# EAGLE design YaskawaSpeedControl_RevB (EAGLE 7.6.0)

## Sheet 1 of 6
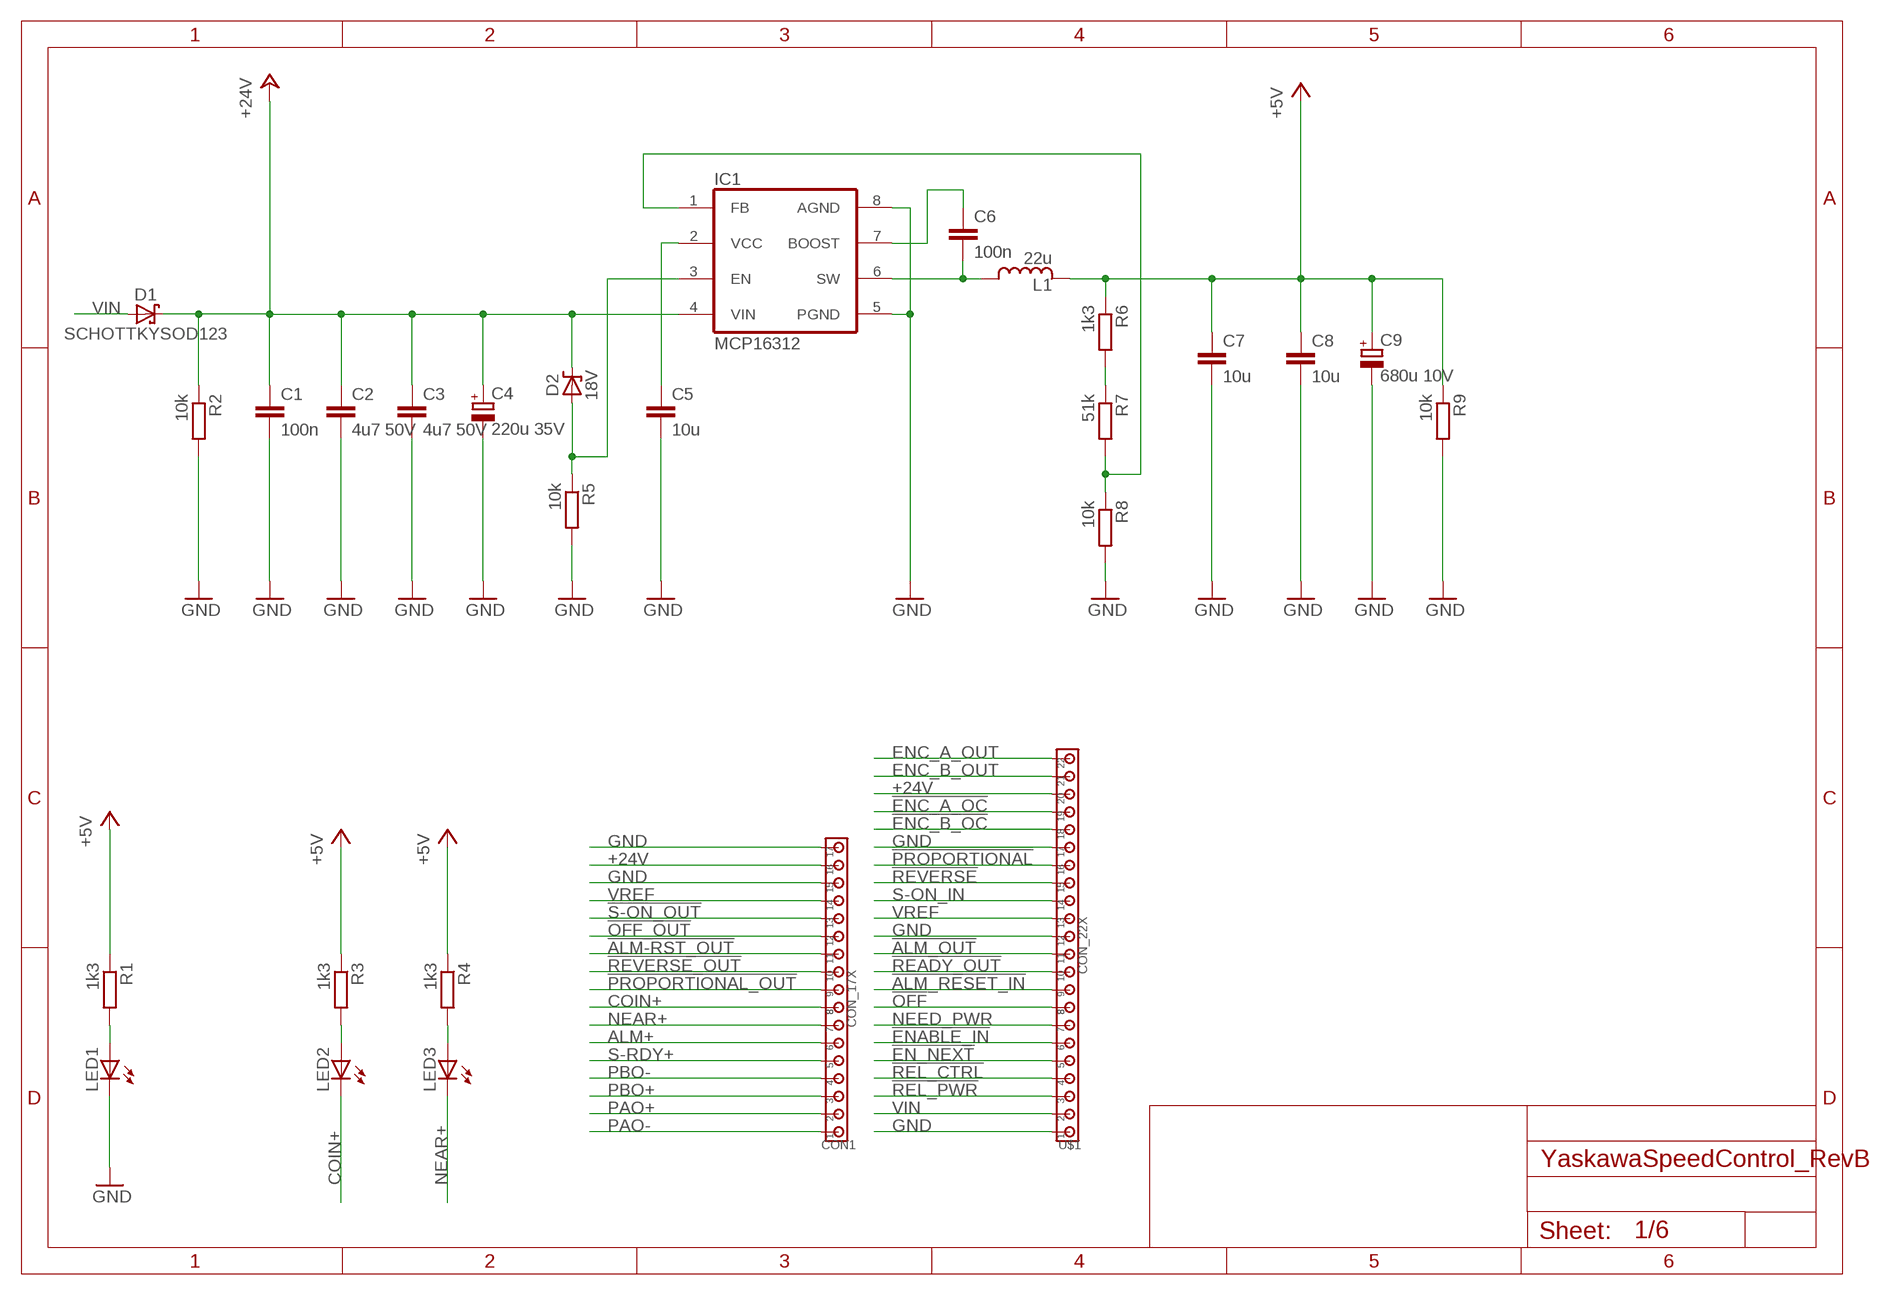
[diagram p0: schematic, sheet 1]

### Parts
C1  100n  CC0805  [C0805]
C2  4u7 50V  CC1206  [C1206]
C3  4u7 50V  CC1206  [C1206]
C4  220u 35V  C_POLARIZED8MM  [8MM]
C5  10u  CC0805  [C0805]
C6  100n  CC0805  [C0805]
C7  10u  CC0805  [C0805]
C8  10u  CC0805  [C0805]
C9  680u 10V  C_POLARIZED8MM  [8MM]
CON1  CON_17X  [3.5MM_17X]
D1  SCHOTTKYSOD123  [SOD123]
D2  18V  ZENERSOD323  [SOD323]
IC1  MCP16312  MCP16311  [MSOP8]
L1  22u  INDUCTORLPS4018  [LPS4018]
LED1  LED0805_NB  [LED0805_NOBOARDER]
LED2  LED0805_NB  [LED0805_NOBOARDER]
LED3  LED0805_NB  [LED0805_NOBOARDER]
R1  1k3  RESISTORR0805  [R0805]
R2  10k  RESISTORR0805  [R0805]
R3  1k3  RESISTORR0805  [R0805]
R4  1k3  RESISTORR0805  [R0805]
R5  10k  RESISTORR0805  [R0805]
R6  1k3  RESISTORR0805  [R0805]
R7  51k  RESISTORR0805  [R0805]
R8  10k  RESISTORR0805  [R0805]
R9  10k  RESISTORR0805  [R0805]
U$1  CON_22X  [3.5MM_22X]

### Nets
!ALM-RST_OUT!: CON1.11 ; also sheet 2
!ALM_OUT!: U$1.11 ; also sheet 2
!ALM_RESET_IN!: U$1.9 ; also sheet 5
!EN_NEXT!: U$1.5 ; also sheet 5
!ENABLE_IN!: U$1.6 ; also sheet 5
!ENC_A_OC!: U$1.19 ; also sheet 2
!ENC_B_OC!: U$1.18 ; also sheet 2
!OFF!: U$1.8 ; also sheet 5
!OFF_OUT!: CON1.12 ; also sheet 2
!PROPORTIONAL!: U$1.16 ; also sheet 6
!PROPORTIONAL_OUT!: CON1.9 ; also sheet 2
!READY_OUT!: U$1.10 ; also sheet 2
!REL_CTRL!: U$1.4 ; also sheet 5
!REL_PWR!: U$1.3 ; also sheet 5
!REVERSE!: U$1.15 ; also sheet 6
!REVERSE_OUT!: CON1.10 ; also sheet 2
!S-ON_OUT!: CON1.13 ; also sheet 2
+5V: C7.1 C8.1 C9.+ L1.2 R1.1 R3.1 R4.1 R6.1 R9.1 ; also sheet 2,3,4,5,6
+24V: C1.1 C2.1 C3.1 C4.+ CON1.16 D1.C D2.C IC1.4(VIN) R2.1 U$1.20 ; also sheet 2,5
ALM+: CON1.6 ; also sheet 5
BOOST: C6.1 IC1.7(BOOST)
COIN+: CON1.8 LED2.C
ENC_A_OUT: U$1.22 ; also sheet 4
ENC_B_OUT: U$1.21 ; also sheet 4
GND: C1.2 C2.2 C3.2 C4.- C5.2 C7.2 C8.2 C9.- CON1.15 CON1.17 IC1.5(PGND) IC1.8(AGND) LED1.C R2.2 R5.2 R8.2 R9.2 U$1.1 U$1.12 U$1.17 ; also sheet 2,3,4,5,6
N$1: IC1.1(FB) R7.2 R8.1
N$2: LED2.A R3.2
N$4: LED3.A R4.2
N$6: LED1.A R1.2
N$8: D2.A IC1.3(EN) R5.1
N$13: R6.2 R7.1
N$14: C5.1 IC1.2(VCC)
NEAR+: CON1.7 LED3.C
NEED_PWR: U$1.7 ; also sheet 5
PAO+: CON1.2 ; also sheet 4
PAO-: CON1.1 ; also sheet 4
PBO+: CON1.3 ; also sheet 4
PBO-: CON1.4 ; also sheet 4
S-ON_IN: U$1.14 ; also sheet 6
S-RDY+: CON1.5 ; also sheet 6
SWITCH: C6.2 IC1.6(SW) L1.1
VIN: D1.A U$1.2
VREF: CON1.14 U$1.13

## Sheet 2 of 6
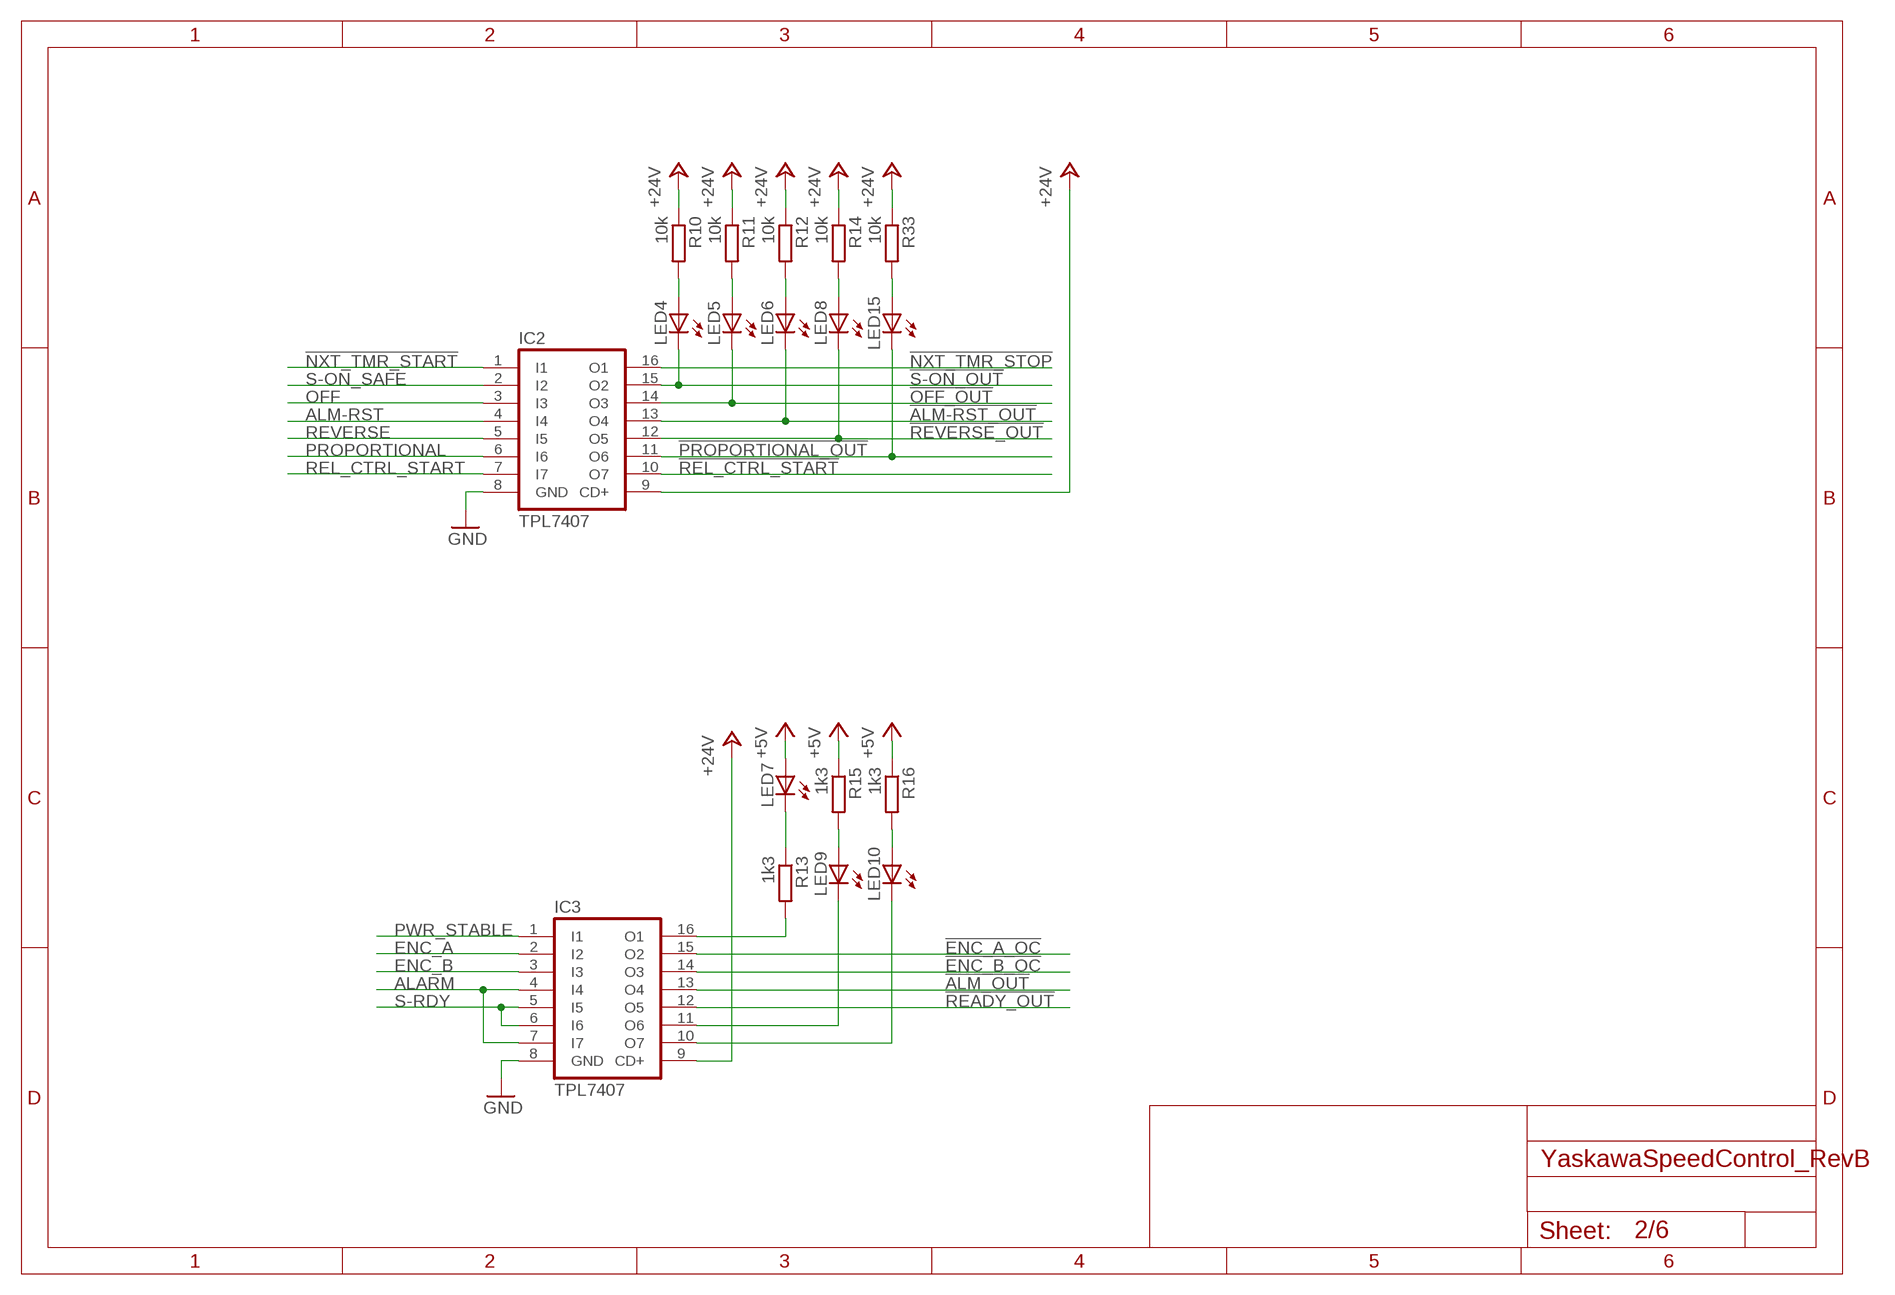
[diagram p1: schematic, sheet 2]

### Parts
IC2  TPL7407  ULN2003  [SO16]
IC3  TPL7407  ULN2003  [SO16]
LED4  LED0805_NB  [LED0805_NOBOARDER]
LED5  LED0805_NB  [LED0805_NOBOARDER]
LED6  LED0805_NB  [LED0805_NOBOARDER]
LED7  LED0805_NB  [LED0805_NOBOARDER]
LED8  LED0805_NB  [LED0805_NOBOARDER]
LED9  LED0805_NB  [LED0805_NOBOARDER]
LED10  LED0805_NB  [LED0805_NOBOARDER]
LED15  LED0805_NB  [LED0805_NOBOARDER]
R10  10k  RESISTORR0805  [R0805]
R11  10k  RESISTORR0805  [R0805]
R12  10k  RESISTORR0805  [R0805]
R13  1k3  RESISTORR0805  [R0805]
R14  10k  RESISTORR0805  [R0805]
R15  1k3  RESISTORR0805  [R0805]
R16  1k3  RESISTORR0805  [R0805]
R33  10k  RESISTORR0805  [R0805]

### Nets
!ALM-RST_OUT!: IC2.13(O4) LED6.C ; also sheet 1
!ALM_OUT!: IC3.13(O4) ; also sheet 1
!ALM_OUT_LED!: IC3.10(O7) LED10.C
!ENC_A_OC!: IC3.15(O2) ; also sheet 1
!ENC_B_OC!: IC3.14(O3) ; also sheet 1
!NXT_TMR_START!: IC2.1(I1) ; also sheet 5
!NXT_TMR_STOP!: IC2.16(O1) ; also sheet 3
!OFF_OUT!: IC2.14(O3) LED5.C ; also sheet 1
!PROPORTIONAL_OUT!: IC2.11(O6) LED15.C ; also sheet 1
!READY_OUT!: IC3.12(O5) ; also sheet 1
!READY_OUT_LED!: IC3.11(O6) LED9.C
!REL_CTRL_START!: IC2.10(O7) ; also sheet 3
!REVERSE_OUT!: IC2.12(O5) LED8.C ; also sheet 1
!S-ON_OUT!: IC2.15(O2) LED4.C ; also sheet 1
+5V: LED7.A R15.1 R16.1 ; also sheet 1,3,4,5,6
+24V: IC2.9(CD+) IC3.9(CD+) R10.1 R11.1 R12.1 R14.1 R33.1 ; also sheet 1,5
ALARM: IC3.4(I4) IC3.7(I7) ; also sheet 5
ALM-RST: IC2.4(I4) ; also sheet 5
ENC_A: IC3.2(I2) ; also sheet 4
ENC_B: IC3.3(I3) ; also sheet 4
GND: IC2.8(GND) IC3.8(GND) ; also sheet 1,3,4,5,6
N$5: LED7.C R13.1
N$22: LED15.A R33.2
N$31: LED4.A R10.2
N$32: IC3.16(O1) R13.2
N$34: LED5.A R11.2
N$35: LED6.A R12.2
N$36: LED8.A R14.2
N$49: LED9.A R15.2
N$50: LED10.A R16.2
OFF: IC2.3(I3) ; also sheet 5
PROPORTIONAL: IC2.6(I6) ; also sheet 6
PWR_STABLE: IC3.1(I1) ; also sheet 3
REL_CTRL_START: IC2.7(I7) ; also sheet 3
REVERSE: IC2.5(I5) ; also sheet 6
S-ON_SAFE: IC2.2(I2) ; also sheet 3
S-RDY: IC3.5(I5) IC3.6(I6) ; also sheet 3,6

## Sheet 3 of 6
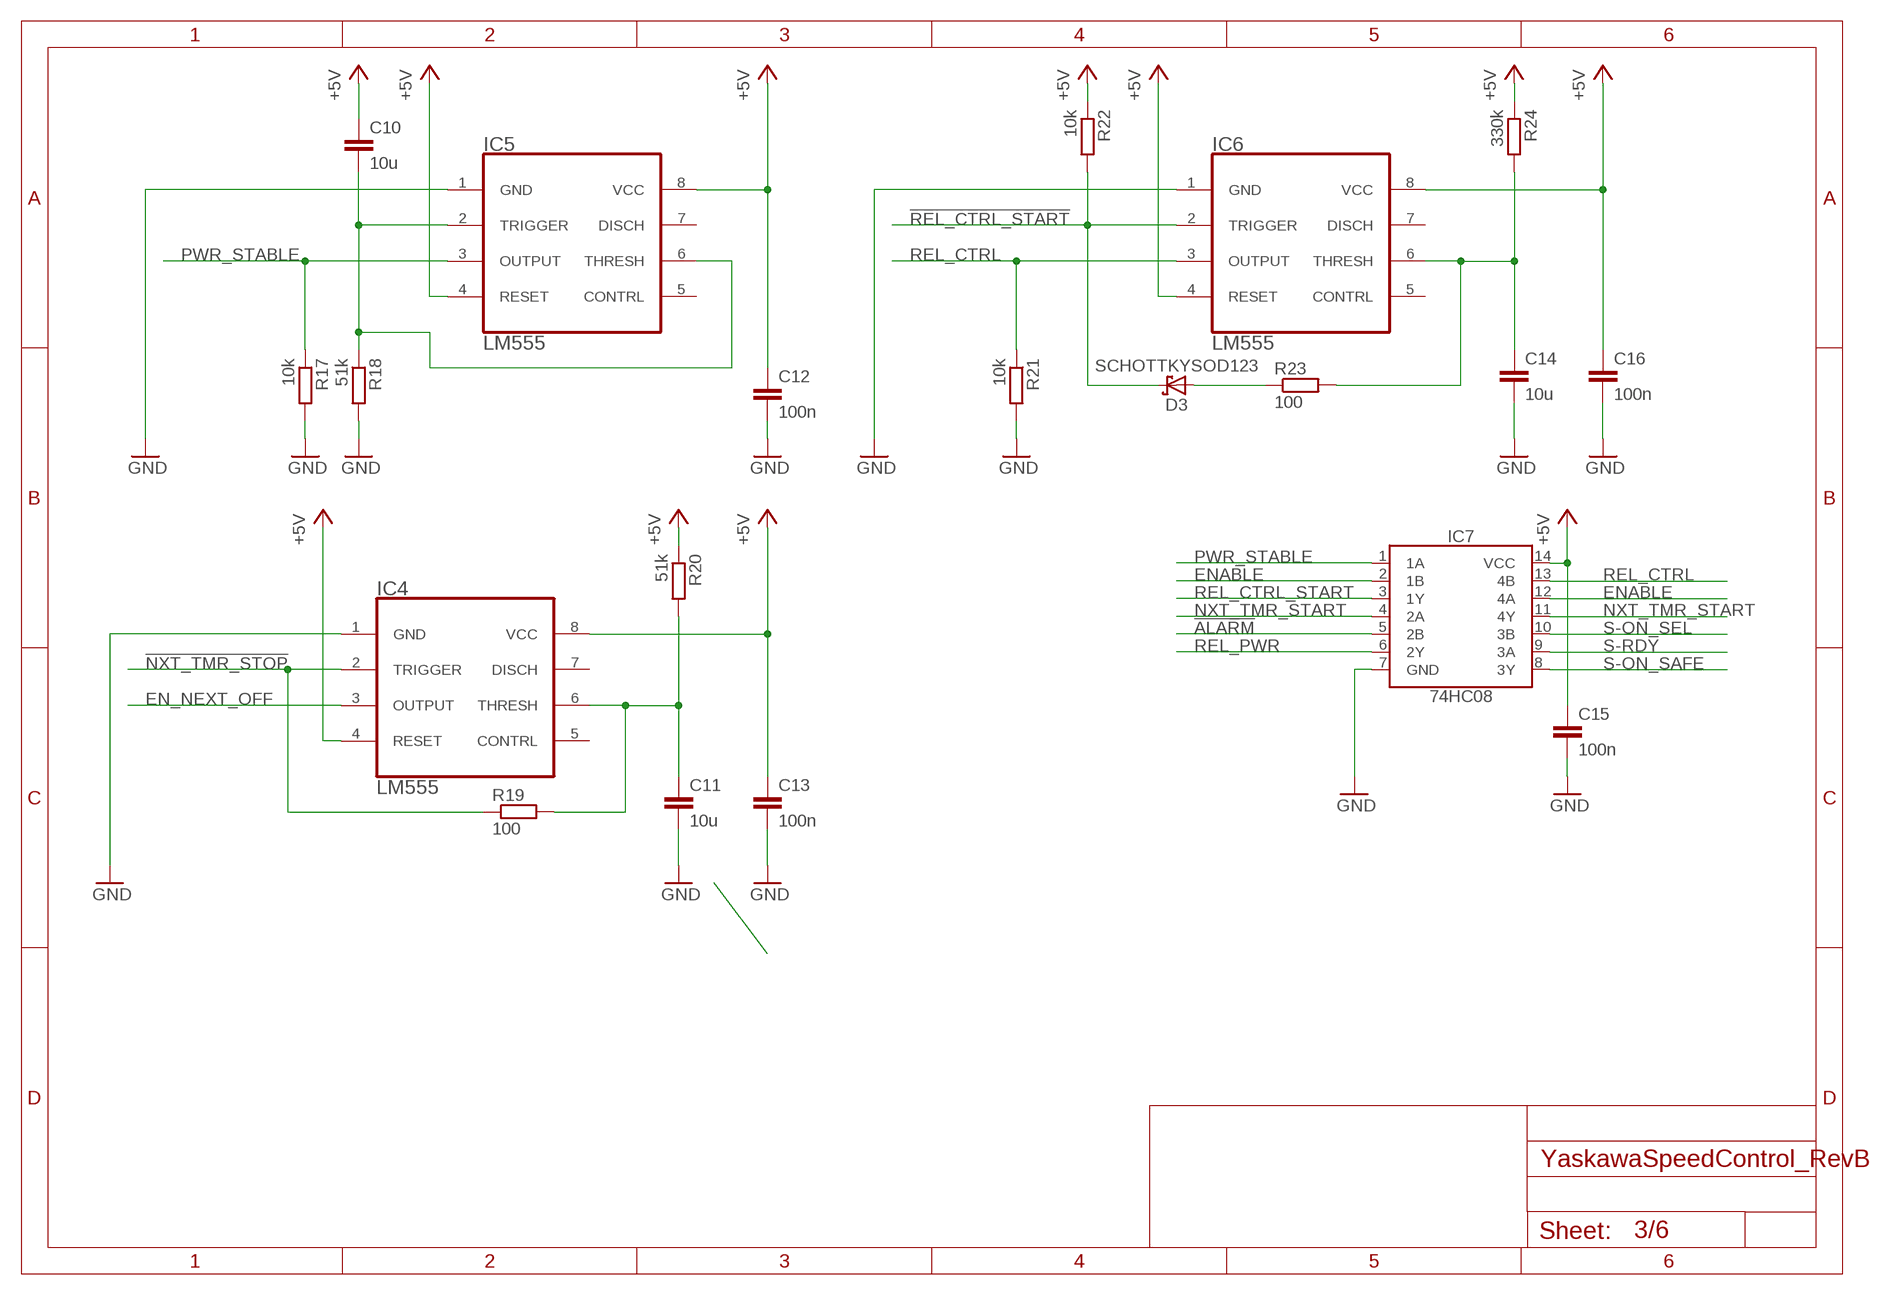
[diagram p2: schematic, sheet 3]

### Parts
C10  10u  CC0805  [C0805]
C11  10u  CC0805  [C0805]
C12  100n  CC0805  [C0805]
C13  100n  CC0805  [C0805]
C14  10u  CC0805  [C0805]
C15  100n  CC0805  [C0805]
C16  100n  CC0805  [C0805]
D3  SCHOTTKYSOD123  [SOD123]
IC4  LM555  [SOIC8]
IC5  LM555  [SOIC8]
IC6  LM555  [SOIC8]
IC7  74HC08  [SO14]
R17  10k  RESISTORR0805  [R0805]
R18  51k  RESISTORR0805  [R0805]
R19  100  RESISTORR0805  [R0805]
R20  51k  RESISTORR0805  [R0805]
R21  10k  RESISTORR0805  [R0805]
R22  10k  RESISTORR0805  [R0805]
R23  100  RESISTORR0805  [R0805]
R24  330k  RESISTORR0805  [R0805]

### Nets
!ALARM!: IC7.5(2B) ; also sheet 5
!NXT_TMR_STOP!: IC4.2(TRIGGER) R19.1 ; also sheet 2
!REL_CTRL_START!: D3.C IC6.2(TRIGGER) R22.2 ; also sheet 2
+5V: C10.1 C12.1 C13.1 C15.1 C16.1 IC4.4(RESET) IC4.8(VCC) IC5.4(RESET) IC5.8(VCC) IC6.4(RESET) IC6.8(VCC) IC7.14(VCC) R20.1 R22.1 R24.1 ; also sheet 1,2,4,5,6
EN_NEXT_OFF: IC4.3(OUTPUT) ; also sheet 6
ENABLE: IC7.2(1B) IC7.12(4A) ; also sheet 5
GND: C11.2 C12.2 C13.2 C14.2 C15.2 C16.2 IC4.1(GND) IC5.1(GND) IC6.1(GND) IC7.7(GND) R17.2 R18.2 R21.2 ; also sheet 1,2,4,5,6
N$11: C10.2 IC5.2(TRIGGER) IC5.6(THRESH) R18.1
N$12: C11.1 IC4.6(THRESH) R19.2 R20.2
N$15: C14.1 IC6.6(THRESH) R23.2 R24.2
N$20: D3.A R23.1
NXT_TMR_START: IC7.4(2A) IC7.11(4Y) ; also sheet 5
PWR_STABLE: IC5.3(OUTPUT) IC7.1(1A) R17.1 ; also sheet 2
REL_CTRL: IC6.3(OUTPUT) IC7.13(4B) R21.1 ; also sheet 5
REL_CTRL_START: IC7.3(1Y) ; also sheet 2
REL_PWR: IC7.6(2Y) ; also sheet 5
S-ON_SAFE: IC7.8(3Y) ; also sheet 2
S-ON_SEL: IC7.10(3B) ; also sheet 6
S-RDY: IC7.9(3A) ; also sheet 2,6
Unconnected: IC4.5(CONTRL) IC4.7(DISCH) IC5.5(CONTRL) IC5.7(DISCH) IC6.5(CONTRL) IC6.7(DISCH)

## Sheet 4 of 6
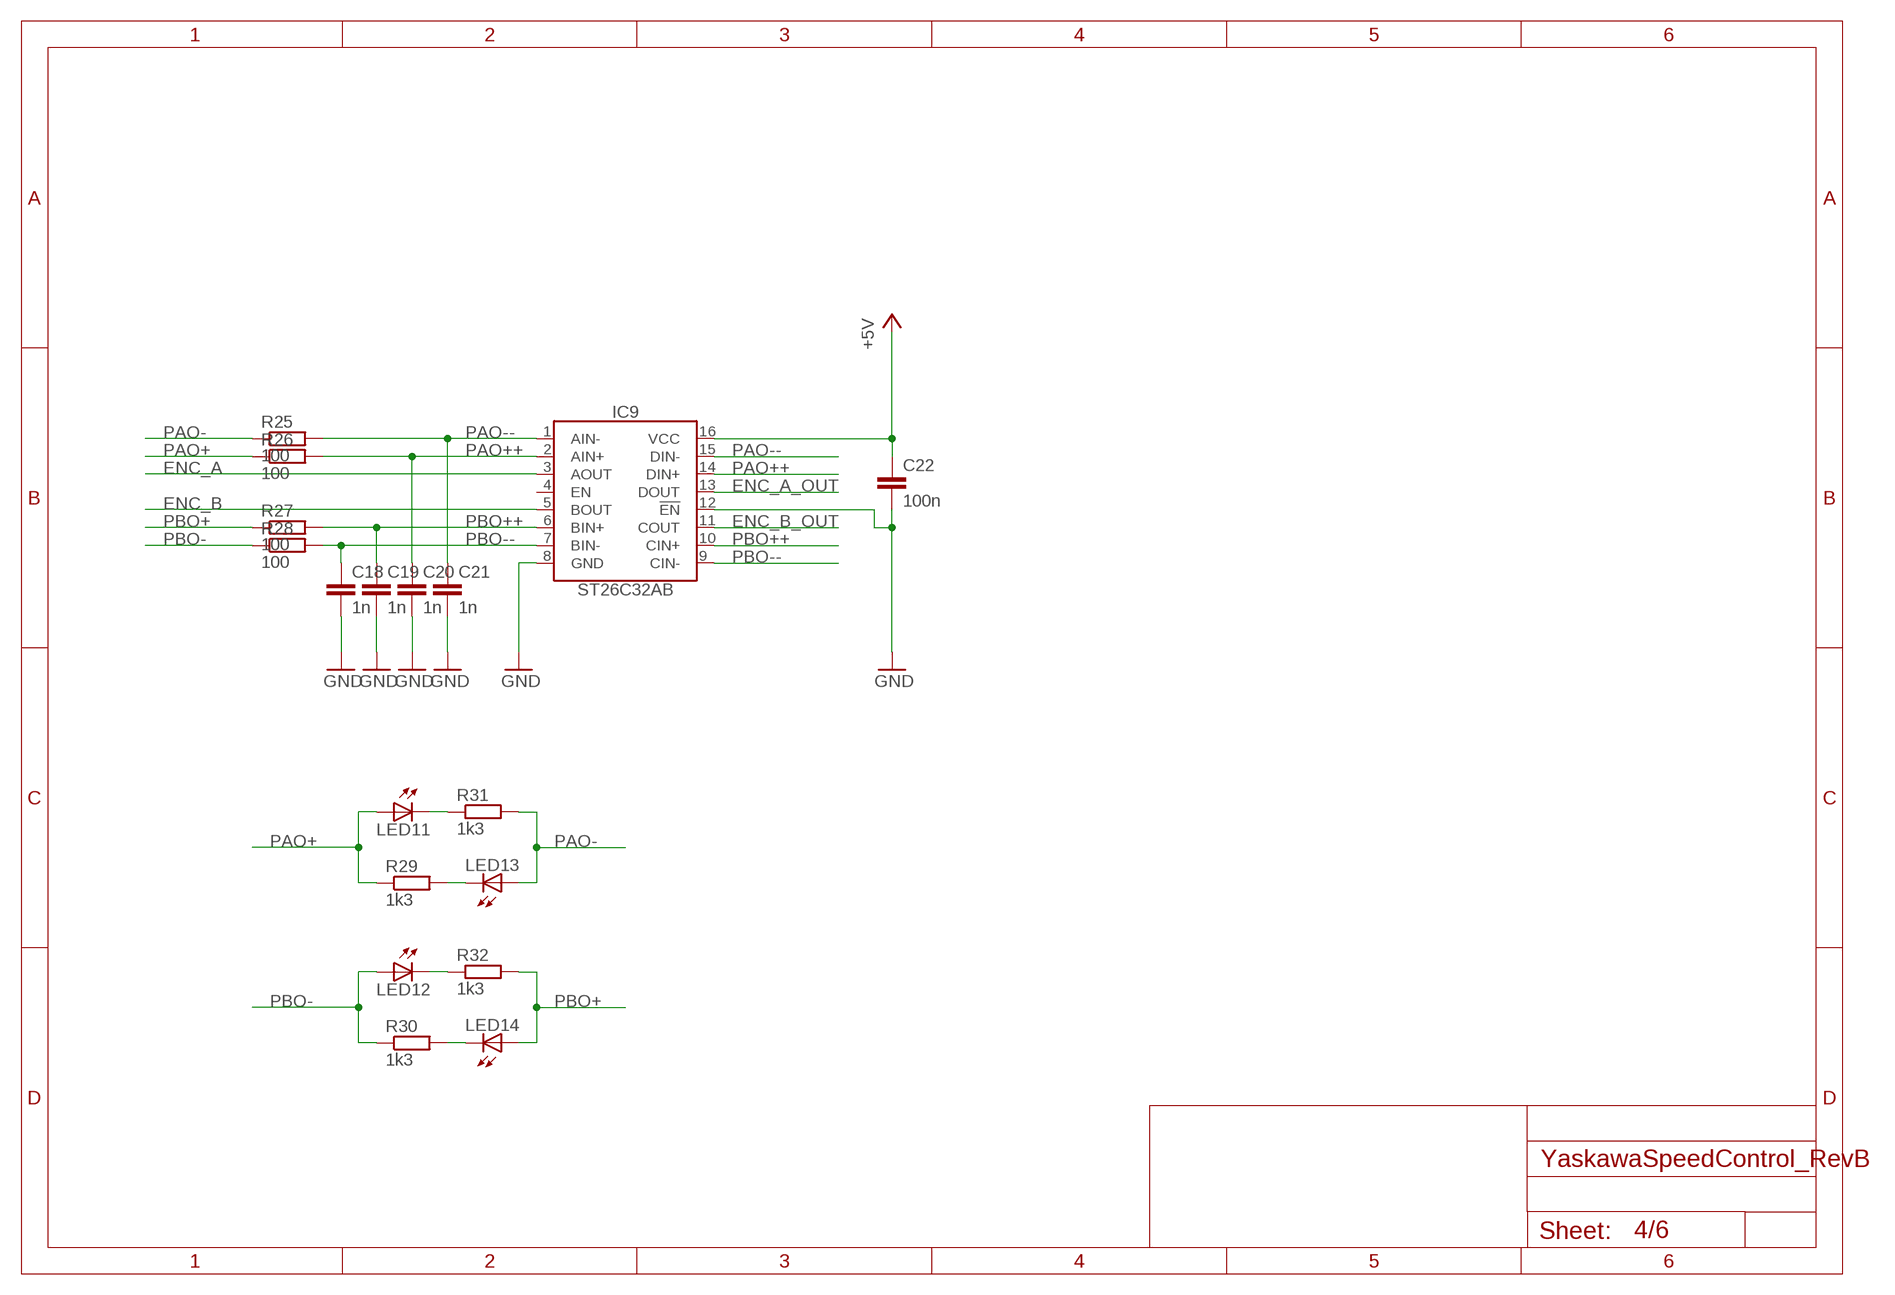
[diagram p3: schematic, sheet 4]

### Parts
C18  1n  CC0805  [C0805]
C19  1n  CC0805  [C0805]
C20  1n  CC0805  [C0805]
C21  1n  CC0805  [C0805]
C22  100n  CC0805  [C0805]
IC9  ST26C32AB  [SO16]
LED11  LED0805_NB  [LED0805_NOBOARDER]
LED12  LED0805_NB  [LED0805_NOBOARDER]
LED13  LED0805_NB  [LED0805_NOBOARDER]
LED14  LED0805_NB  [LED0805_NOBOARDER]
R25  100  RESISTORR0805  [R0805]
R26  100  RESISTORR0805  [R0805]
R27  100  RESISTORR0805  [R0805]
R28  100  RESISTORR0805  [R0805]
R29  1k3  RESISTORR0805  [R0805]
R30  1k3  RESISTORR0805  [R0805]
R31  1k3  RESISTORR0805  [R0805]
R32  1k3  RESISTORR0805  [R0805]

### Nets
+5V: C22.1 IC9.16(VCC) ; also sheet 1,2,3,5,6
ENC_A: IC9.3(AOUT) ; also sheet 2
ENC_A_OUT: IC9.13(DOUT) ; also sheet 1
ENC_B: IC9.5(BOUT) ; also sheet 2
ENC_B_OUT: IC9.11(COUT) ; also sheet 1
GND: C18.2 C19.2 C20.2 C21.2 C22.2 IC9.8(GND) IC9.12(!EN!) ; also sheet 1,2,3,5,6
N$18: LED11.C R31.1
N$19: LED12.C R32.1
N$51: LED13.C R29.2
N$53: LED14.C R30.2
PAO+: LED11.A R26.1 R29.1 ; also sheet 1
PAO++: C20.1 IC9.2(AIN+) IC9.14(DIN+) R26.2
PAO-: LED13.A R25.1 R31.2 ; also sheet 1
PAO--: C21.1 IC9.1(AIN-) IC9.15(DIN-) R25.2
PBO+: LED14.A R27.1 R32.2 ; also sheet 1
PBO++: C19.1 IC9.6(BIN+) IC9.10(CIN+) R27.2
PBO-: LED12.A R28.1 R30.1 ; also sheet 1
PBO--: C18.1 IC9.7(BIN-) IC9.9(CIN-) R28.2
Unconnected: IC9.4(EN)

## Sheet 5 of 6
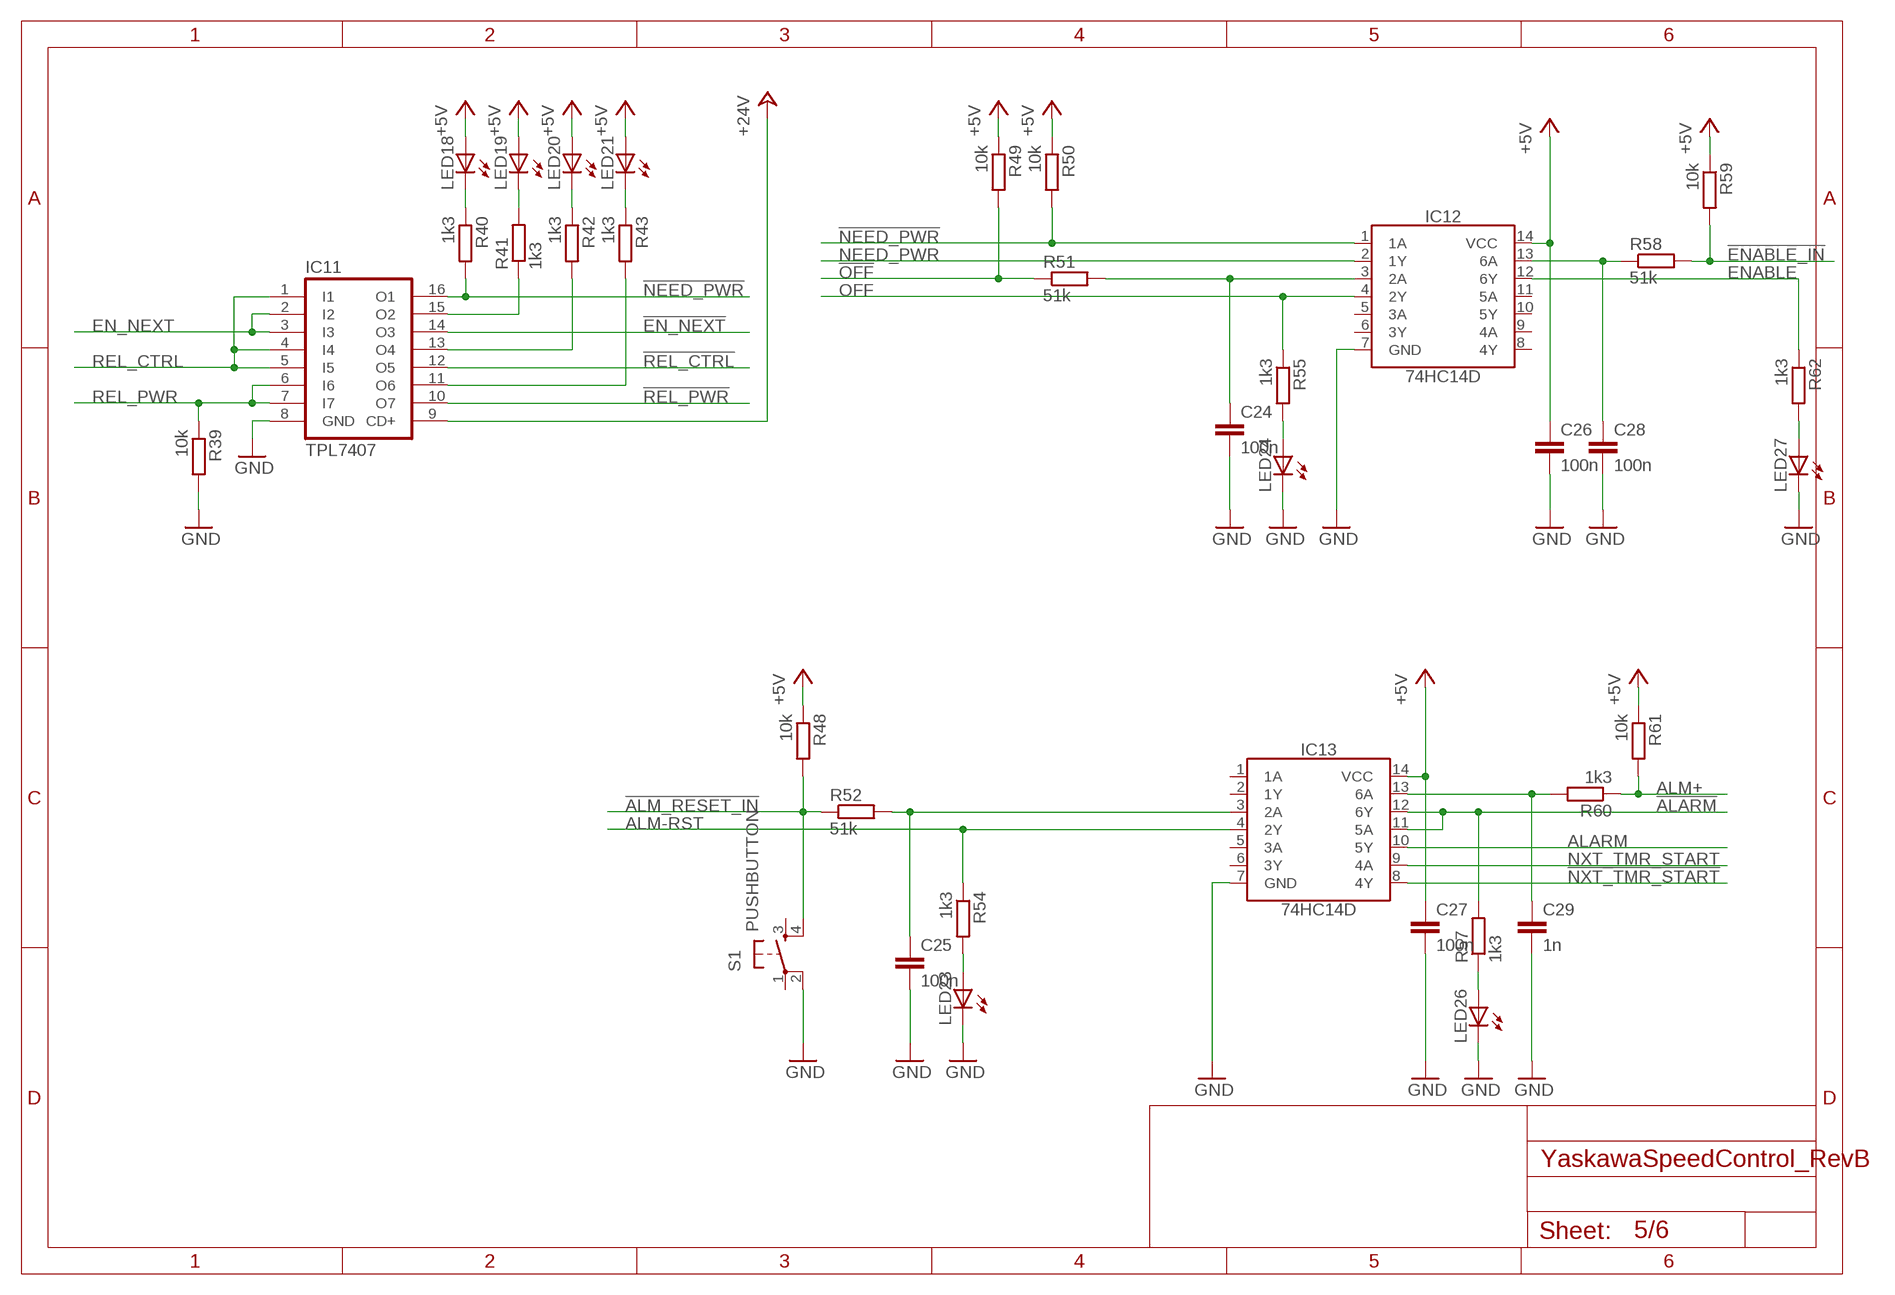
[diagram p4: schematic, sheet 5]

### Parts
C24  100n  CC0805  [C0805]
C25  100n  CC0805  [C0805]
C26  100n  CC0805  [C0805]
C27  100n  CC0805  [C0805]
C28  100n  CC0805  [C0805]
C29  1n  CC0805  [C0805]
IC11  TPL7407  ULN2003  [SO16]
IC12  74HC14D  [SO14]
IC13  74HC14D  [SO14]
LED18  LED0805_NB  [LED0805_NOBOARDER]
LED19  LED0805_NB  [LED0805_NOBOARDER]
LED20  LED0805_NB  [LED0805_NOBOARDER]
LED21  LED0805_NB  [LED0805_NOBOARDER]
LED23  LED0805_NB  [LED0805_NOBOARDER]
LED24  LED0805_NB  [LED0805_NOBOARDER]
LED26  LED0805_NB  [LED0805_NOBOARDER]
LED27  LED0805_NB  [LED0805_NOBOARDER]
R39  10k  RESISTORR0805  [R0805]
R40  1k3  RESISTORR0805  [R0805]
R41  1k3  RESISTORR0805  [R0805]
R42  1k3  RESISTORR0805  [R0805]
R43  1k3  RESISTORR0805  [R0805]
R48  10k  RESISTORR0805  [R0805]
R49  10k  RESISTORR0805  [R0805]
R50  10k  RESISTORR0805  [R0805]
R51  51k  RESISTORR0805  [R0805]
R52  51k  RESISTORR0805  [R0805]
R54  1k3  RESISTORR0805  [R0805]
R55  1k3  RESISTORR0805  [R0805]
R57  1k3  RESISTORR0805  [R0805]
R58  51k  RESISTORR0805  [R0805]
R59  10k  RESISTORR0805  [R0805]
R60  1k3  RESISTORR0805  [R0805]
R61  10k  RESISTORR0805  [R0805]
R62  1k3  RESISTORR0805  [R0805]
S1  PUSHBUTTON  [TE_FSMJSM]

### Nets
!ALARM!: IC13.11(5A) IC13.12(6Y) R57.2 ; also sheet 3
!ALM_RESET_IN!: R48.2 R52.1 S1.4(S1) ; also sheet 1
!EN_NEXT!: IC11.14(O3) ; also sheet 1
!EN_NEXT_LED!: IC11.15(O2) R41.1
!ENABLE_IN!: R58.2 R59.2 ; also sheet 1
!NEED_PWR!: IC11.16(O1) IC12.1(1A) R40.2 R50.2
!NXT_TMR_START!: IC13.8(4Y) ; also sheet 2
!OFF!: R49.2 R51.1 ; also sheet 1
!REL_CTRL!: IC11.12(O5) ; also sheet 1
!REL_CTRL_LED!: IC11.13(O4) R42.2
!REL_PWR!: IC11.10(O7) ; also sheet 1
!REL_PWR_LED!: IC11.11(O6) R43.2
+5V: C26.1 C27.1 IC12.14(VCC) IC13.14(VCC) LED18.A LED19.A LED20.A LED21.A R48.1 R49.1 R50.1 R59.1 R61.1 ; also sheet 1,2,3,4,6
+24V: IC11.9(CD+) ; also sheet 1,2
ALARM: IC13.10(5Y) ; also sheet 2
ALM+: R60.1 R61.2 ; also sheet 1
ALM++: C29.1 IC13.13(6A) R60.2
ALM-RST: IC13.4(2Y) R54.1 ; also sheet 2
EN_NEXT: IC11.2(I2) IC11.3(I3) ; also sheet 6
ENABLE: IC12.12(6Y) R62.1 ; also sheet 3
GND: C24.2 C25.2 C26.2 C27.2 C28.2 C29.2 IC11.8(GND) IC12.7(GND) IC13.7(GND) LED23.C LED24.C LED26.C LED27.C R39.2 S1.2(P1) ; also sheet 1,2,3,4,6
N$16: C28.1 IC12.13(6A) R58.1
N$21: C25.1 IC13.3(2A) R52.2
N$23: C24.1 IC12.3(2A) R51.2
N$38: LED23.A R54.2
N$39: LED24.A R55.2
N$40: LED19.C R41.2
N$41: LED18.C R40.1
N$43: LED20.C R42.1
N$45: LED21.C R43.1
N$46: LED27.A R62.2
N$55: LED26.A R57.1
NEED_PWR: IC12.2(1Y) ; also sheet 1
NXT_TMR_START: IC13.9(4A) ; also sheet 3
OFF: IC12.4(2Y) R55.1 ; also sheet 2
REL_CTRL: IC11.1(I1) IC11.4(I4) IC11.5(I5) ; also sheet 3
REL_PWR: IC11.6(I6) IC11.7(I7) R39.1 ; also sheet 3
Unconnected: IC12.5(3A) IC12.6(3Y) IC12.8(4Y) IC12.9(4A) IC12.10(5Y) IC12.11(5A) IC13.1(1A) IC13.2(1Y) IC13.5(3A) IC13.6(3Y) S1.1(P) S1.3(S)

## Sheet 6 of 6
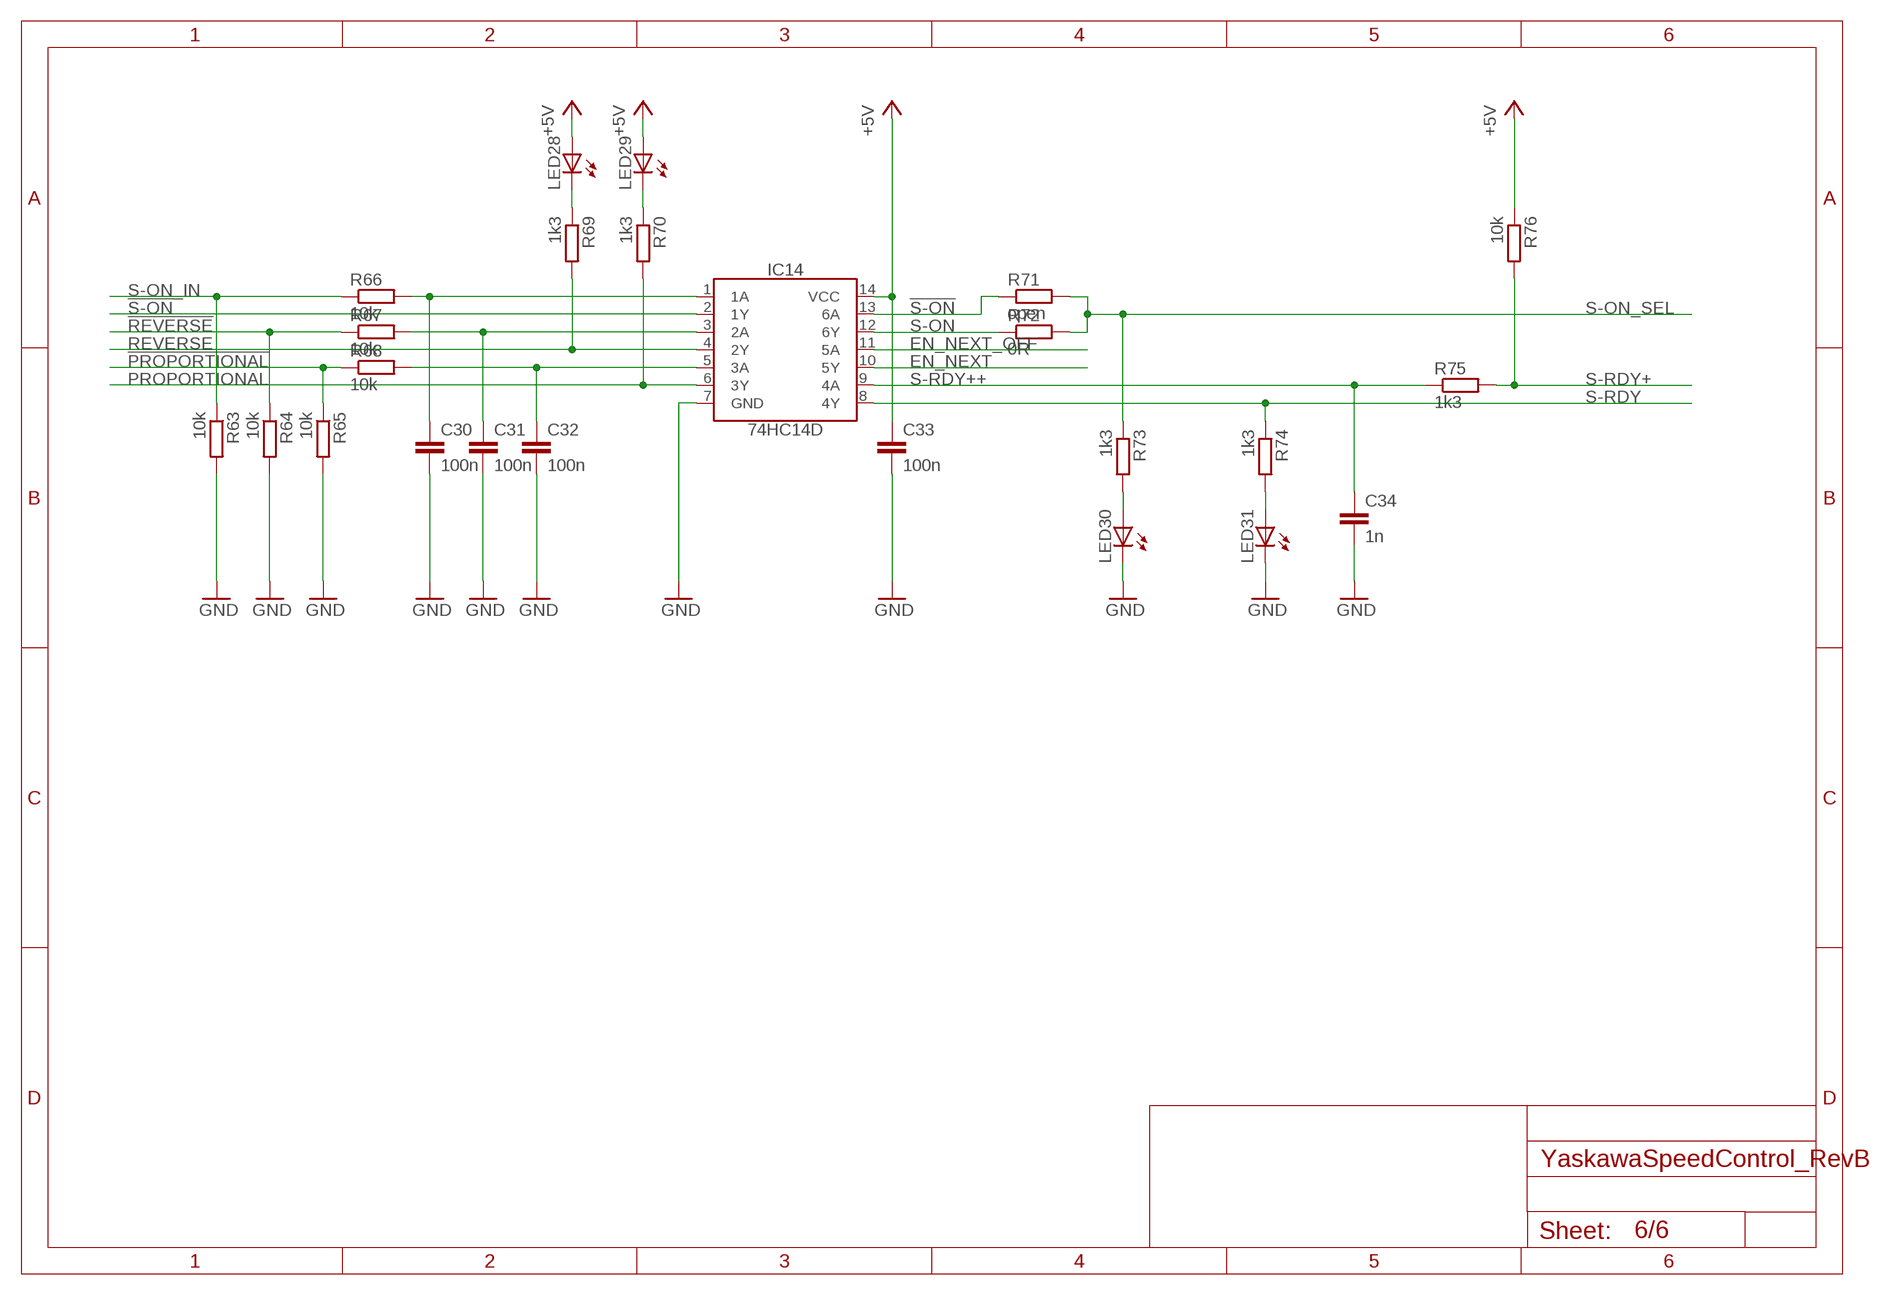
[diagram p5: schematic, sheet 6]

### Parts
C30  100n  CC0805  [C0805]
C31  100n  CC0805  [C0805]
C32  100n  CC0805  [C0805]
C33  100n  CC0805  [C0805]
C34  1n  CC0805  [C0805]
IC14  74HC14D  [SO14]
LED28  LED0805_NB  [LED0805_NOBOARDER]
LED29  LED0805_NB  [LED0805_NOBOARDER]
LED30  LED0805_NB  [LED0805_NOBOARDER]
LED31  LED0805_NB  [LED0805_NOBOARDER]
R63  10k  RESISTORR0805  [R0805]
R64  10k  RESISTORR0805  [R0805]
R65  10k  RESISTORR0805  [R0805]
R66  10k  RESISTORR0805  [R0805]
R67  10k  RESISTORR0805  [R0805]
R68  10k  RESISTORR0805  [R0805]
R69  1k3  RESISTORR0805  [R0805]
R70  1k3  RESISTORR0805  [R0805]
R71  open  RESISTORR0805  [R0805]
R72  0R  RESISTORR0805  [R0805]
R73  1k3  RESISTORR0805  [R0805]
R74  1k3  RESISTORR0805  [R0805]
R75  1k3  RESISTORR0805  [R0805]
R76  10k  RESISTORR0805  [R0805]

### Nets
!PROPORTIONAL!: R65.1 R68.1 ; also sheet 1
!REVERSE!: R64.1 R67.1 ; also sheet 1
!S-ON!: IC14.2(1Y) IC14.13(6A) R71.1
+5V: C33.1 IC14.14(VCC) LED28.A LED29.A R76.1 ; also sheet 1,2,3,4,5
EN_NEXT: IC14.10(5Y) ; also sheet 5
EN_NEXT_OFF: IC14.11(5A) ; also sheet 3
GND: C30.2 C31.2 C32.2 C33.2 C34.2 IC14.7(GND) LED30.C LED31.C R63.2 R64.2 R65.2 ; also sheet 1,2,3,4,5
N$17: LED29.C R70.1
N$27: C30.1 IC14.1(1A) R66.2
N$28: C31.1 IC14.3(2A) R67.2
N$29: C32.1 IC14.5(3A) R68.2
N$30: LED28.C R69.1
N$33: LED30.A R73.2
N$56: LED31.A R74.2
PROPORTIONAL: IC14.6(3Y) R70.2 ; also sheet 2
REVERSE: IC14.4(2Y) R69.2 ; also sheet 2
S-ON: IC14.12(6Y) R72.1
S-ON_IN: R63.1 R66.1 ; also sheet 1
S-ON_SEL: R71.2 R72.2 R73.1 ; also sheet 3
S-RDY: IC14.8(4Y) R74.1 ; also sheet 2,3
S-RDY+: R75.2 R76.2 ; also sheet 1
S-RDY++: C34.1 IC14.9(4A) R75.1

## Library data of the parts
C1-C3 C5-C8 C10-C16 C18-C22 C24-C34 = 00Capacitor:C: Capacitor
C4 C9 = 00Capacitor:C_POLARIZED
CON1 = 00Connector:CON_17X
D1 D3 = 00Diode:SCHOTTKY
D2 = 00Diode:ZENER
IC1 = 00VoltageRegulator:MCP16311
IC2 IC3 IC11 = 00Transistor:ULN2003: Seven Darlington array
IC4-IC6 = 00Logic:LM555
IC7 = 00Logic:74HC08: Quad 2-input AND gate
IC9 = 00Logic:ST26C32AB: CMOS quad 3-state differential line receiver
IC12-IC14 = 00Logic:74HC14: Hex Inverter Schmitt Trigger
L1 = 00Inductor:INDUCTOR
LED1-LED15 LED18-LED21 LED23 LED24 LED26-LED31 = 00Display:LED: LED
R1-R33 R39-R43 R48-R52 R54 R55 R57-R76 = 00Resistor:RESISTOR: RESISTOR, European symbol
S1 = 00Switch:PUSHBUTTON: Pushbutton
U$1 = 00Connector:CON_22X

## Net classes
1 24V: clearance 0.305 mm
5 +5v: width 0.61 mm, drill 0.6 mm, clearance 0.254 mm to class 0, clearance 0.254 mm to class 1, clearance 0.254 mm to class 2, clearance 0.254 mm to class 3, clearance 0.254 mm to class 4, clearance 0.254 mm

## Board
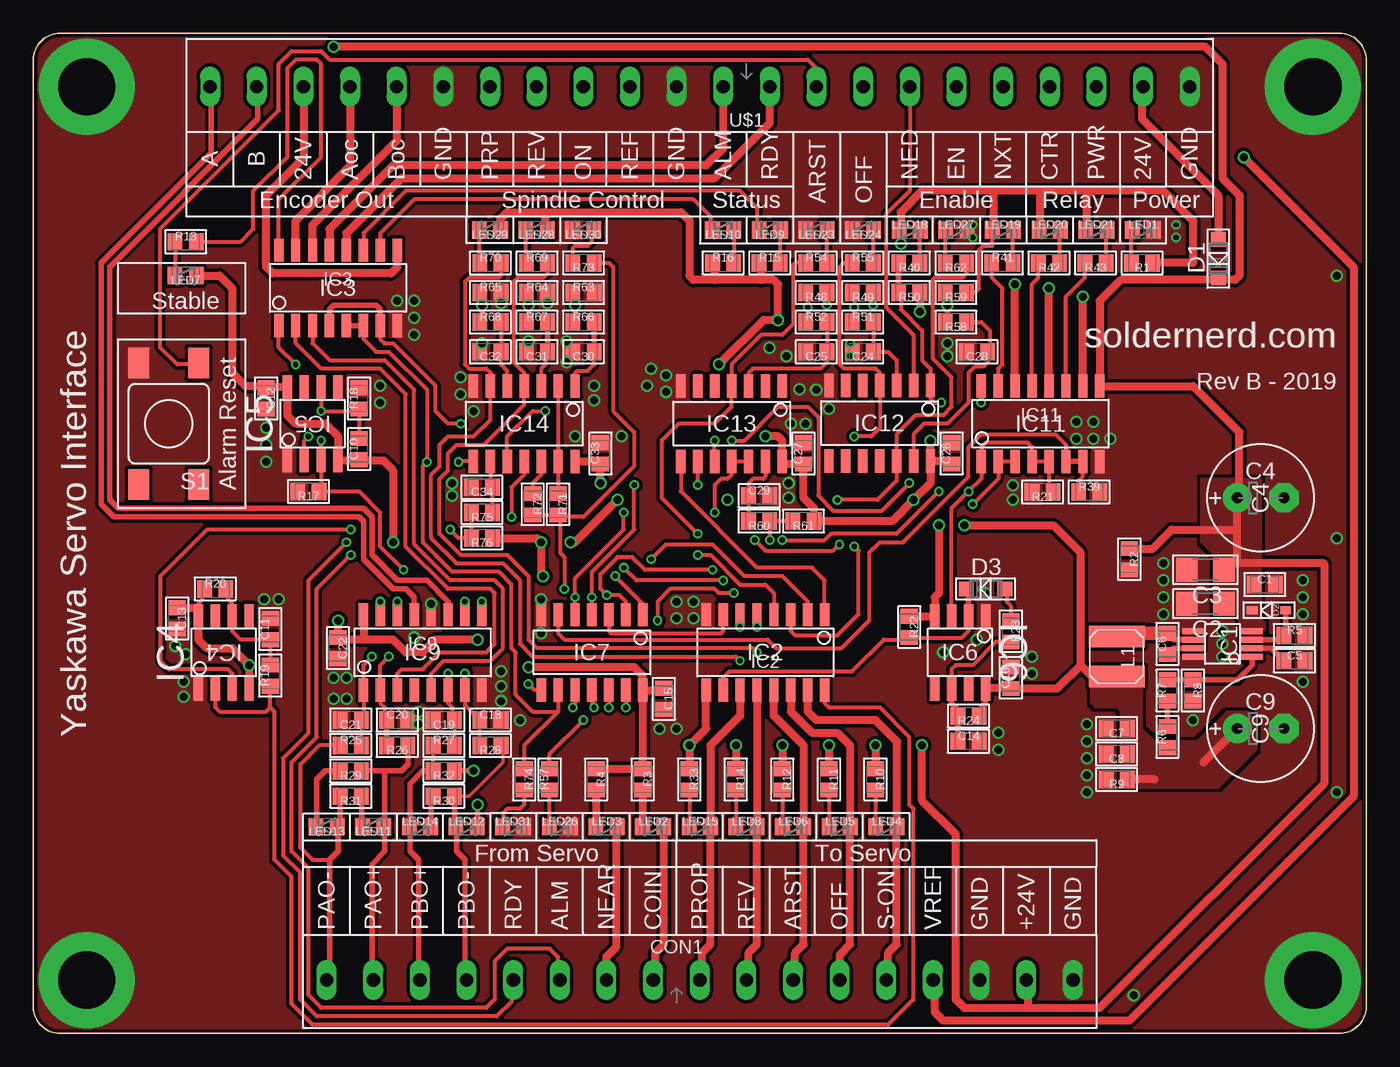
[diagram p6: board, top side]
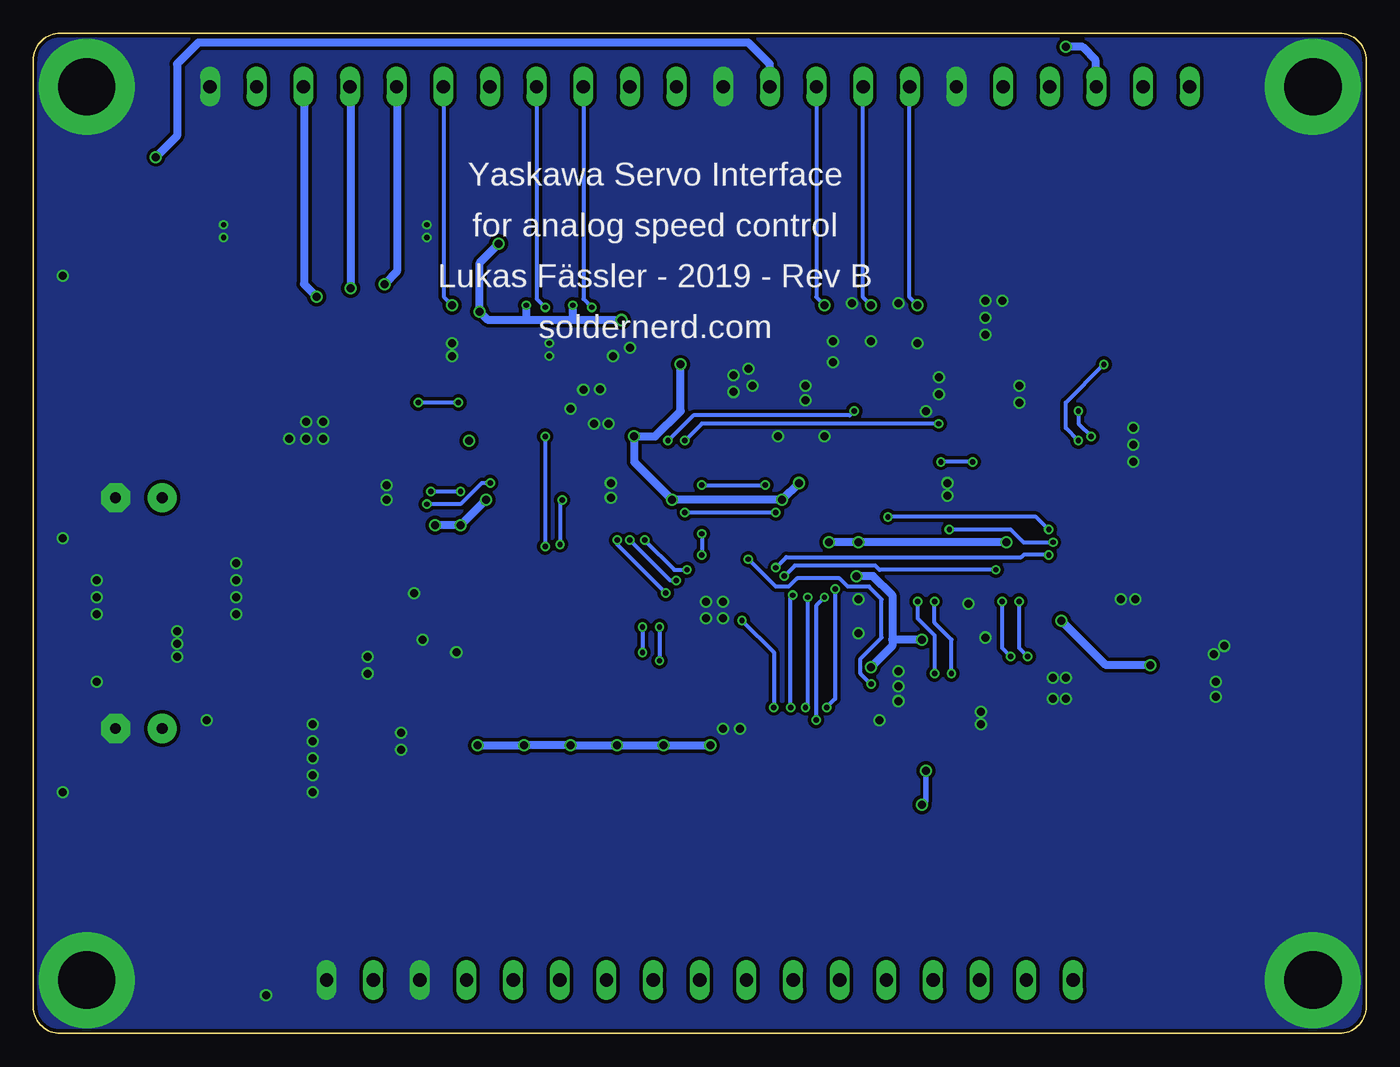
[diagram p7: board, bottom side, seen from below]

Size 100 x 75 mm. Coordinates in mm from the lower left corner, seen from the top.
Outline: 98,0 arc90 100,2 100,73 arc90 98,75 2,75 arc90 0,73 0,2 arc90 2,0 98,0
Copper layers (1*16): Top 0.035mm / dielectric 1.5mm / Bottom 0.035mm
Design rules "dirt_cheap_dirty_boards.6mil": minimum track width 6mil, minimum drill 12mil, track to track 6mil, track to pad 6mil, pad to pad 6mil, via to via 6mil, smd to smd 0mil, copper to edge 10mil, drill to drill 10mil, minimum pad ring 8mil, minimum via ring 6mil, stop-mask expansion 2mil, vias tented up to drill 25mil, thermal gap 10mil

### Footprints (pad centres in the part's own frame; a part is rotated, then mirrored left to right if it is on the bottom)
C0805 = smd 1.1 x 1.3: 1 -0.8,0; 2 0.8,0
C1206 = smd 1.6 x 1.8: 1 -1.4,0; 2 1.4,0
8MM = drill 0.8 pad 2.2: + -1.75,0 | drill 0.8 pad 2.2 octagon: - 1.75,0
3.5MM_17X = drill 1 long: 1 -28,0; 2 -24.5,0; 3 -21,0; 4 -17.5,0; 5 -14,0; 6 -10.5,0; 7 -7,0; 8 -3.5,0; 9 0,0; 10 3.5,0; 11 7,0; 12 10.5,0; 13 14,0; 14 17.5,0; 15 21,0; 16 24.5,0; 17 28,0
SOD123 = smd 1.1 x 1.1: A 1.45,0; C -1.45,0
SOD323 = smd 0.8 x 0.6: A 1.25,0; C -1.25,0
MSOP8 = smd 1.65 x 0.45: 1 -2.2,0.953; 2 -2.2,0.318; 3 -2.2,-0.318; 4 -2.2,-0.953; 5 2.2,-0.953; 6 2.2,-0.318; 7 2.2,0.318; 8 2.2,0.953
SO16 = smd 0.7 x 1.75: 1 -4.445,-2.825; 2 -3.175,-2.825; 3 -1.905,-2.825; 4 -0.635,-2.825; 5 0.635,-2.825; 6 1.905,-2.825; 7 3.175,-2.825; 8 4.445,-2.825; 9 4.445,2.825; 10 3.175,2.825; 11 1.905,2.825; 12 0.635,2.825; 13 -0.635,2.825; 14 -1.905,2.825; 15 -3.175,2.825; 16 -4.445,2.825
SOIC8 = smd 1.75 x 0.7: 1 -2.75,1.905; 2 -2.75,0.635; 3 -2.75,-0.635; 4 -2.75,-1.905; 5 2.75,-1.905; 6 2.75,-0.635; 7 2.75,0.635; 8 2.75,1.905
SO14 = smd 0.7 x 1.75: 1 -3.81,-2.825; 2 -2.54,-2.825; 3 -1.27,-2.825; 4 0,-2.825; 5 1.27,-2.825; 6 2.54,-2.825; 7 3.81,-2.825; 8 3.81,2.825; 9 2.54,2.825; 10 1.27,2.825; 11 0,2.825; 12 -1.27,2.825; 13 -2.54,2.825; 14 -3.81,2.825
LPS4018 = smd 1.6 x 4.2: 1 -1.5,0; 2 1.5,0
LED0805_NOBOARDER = smd 1.1 x 1.3: A -0.8,0; C 0.8,0
R0805 = smd 1.1 x 1.3: 1 -0.8,0; 2 0.8,0
TE_FSMJSM = smd 1.6 x 2.3: 1 2.25,4.55; 2 2.25,-4.55; 3 -2.25,4.55; 4 -2.25,-4.55
3.5MM_22X = drill 1 long: 1 -36.75,0; 2 -33.25,0; 3 -29.75,0; 4 -26.25,0; 5 -22.75,0; 6 -19.25,0; 7 -15.75,0; 8 -12.25,0; 9 -8.75,0; 10 -5.25,0; 11 -1.75,0; 12 1.75,0; 13 5.25,0; 14 8.75,0; 15 12.25,0; 16 15.75,0; 17 19.25,0; 18 22.75,0; 19 26.25,0; 20 29.75,0; 21 33.25,0; 22 36.75,0

### Placement (x,y rotation side)
C1  92.39,33.66 0 top
C2  87.95,32.23 180 top
C3  87.95,34.77 180 top
C4  92.08,40.16 0 top
C5  94.61,27.94 0 top
C6  85.09,29.21 90 top
C7  81.28,22.86 180 top
C8  81.28,20.95 180 top
C9  92.08,22.86 0 top
C10  24.45,43.81 90 top
C11  17.78,30.32 90 top
C12  17.46,47.62 270 top
C13  10.79,31.11 270 top
C14  70.17,21.91 0 top
C15  47.31,25.08 270 top
C16  73.34,26.67 90 top
C18  34.29,23.5 0 top
C19  30.8,23.5 180 top
C20  27.3,23.5 0 top
C21  23.81,23.5 180 top
C22  22.86,28.89 270 top
C24  62.23,51.12 180 top
C25  58.74,51.12 180 top
C26  68.9,43.5 90 top
C27  57.78,43.5 90 top
C28  70.8,51.12 180 top
C29  54.45,40.32 0 top
C30  41.27,51.12 180 top
C31  37.78,51.12 180 top
C32  34.29,51.12 180 top
C33  42.55,43.5 90 top
C34  33.66,40.96 180 top
CON1  50,4 0 top
D1  88.9,58.1 90 top
D2  92.71,31.75 0 top
D3  71.44,33.34 0 top
IC1  89.22,29.21 180 top
IC2  54.93,28.57 180 top
IC3  22.86,55.9 0 top
IC4  14.29,28.57 90 top
IC5  20.95,45.72 90 top
IC6  69.53,28.57 270 top
IC7  41.91,28.57 180 top
IC9  29.21,28.57 0 top
IC11  75.56,45.72 0 top
IC12  63.5,45.76 180 top
IC13  52.39,45.72 180 top
IC14  36.83,45.72 180 top
L1  81.28,28.26 270 top
LED1  83.25,60.25 0 top
LED2  46.5,15.5 0 top
LED3  43,15.5 0 top
LED4  64,15.5 0 top
LED5  60.5,15.5 0 top
LED6  57,15.5 0 top
LED7  11.43,56.83 180 top
LED8  53.5,15.5 0 top
LED9  55.25,60.25 180 top
LED10  51.75,60.25 180 top
LED11  25.5,15.5 180 top
LED12  32.5,15.5 0 top
LED13  22,15.5 180 top
LED14  29,15.5 0 top
LED15  50,15.5 0 top
LED18  65.75,60.25 0 top
LED19  72.75,60.25 0 top
LED20  76.25,60.25 0 top
LED21  79.75,60.25 0 top
LED23  58.75,60.25 180 top
LED24  62.25,60.25 180 top
LED26  39.5,15.5 0 top
LED27  69.25,60.25 0 top
LED28  37.75,60.25 180 top
LED29  34.25,60.25 180 top
LED30  41.25,60.25 180 top
LED31  36,15.5 0 top
R1  83.19,57.78 180 top
R2  82.23,35.56 270 top
R3  45.72,19.05 270 top
R4  42.23,19.05 270 top
R5  94.61,29.84 0 top
R6  85.09,22.23 90 top
R7  85.09,25.72 90 top
R8  87,25.72 270 top
R9  81.28,19.05 180 top
R10  63.18,19.05 270 top
R11  59.69,19.05 270 top
R12  56.2,19.05 270 top
R13  11.43,59.37 0 top
R14  52.7,19.05 270 top
R15  55.24,57.78 0 top
R16  51.75,57.78 0 top
R17  20.64,40.64 180 top
R18  24.45,47.62 90 top
R19  17.78,26.83 90 top
R20  13.65,33.34 0 top
R21  75.72,40.6 180 top
R22  65.72,30.48 270 top
R23  73.34,30.16 270 top
R24  70.17,23.81 180 top
R25  23.81,21.59 0 top
R26  27.3,21.59 180 top
R27  30.8,21.59 0 top
R28  34.29,21.59 180 top
R29  23.81,19.68 180 top
R30  30.8,17.78 180 top
R31  23.81,17.78 180 top
R32  30.8,19.68 180 top
R33  49.21,19.05 270 top
R39  79.22,40.6 0 top
R40  65.72,57.78 180 top
R41  72.71,57.78 0 top
R42  76.2,57.78 180 top
R43  79.69,57.78 180 top
R48  58.74,55.56 180 top
R49  62.23,55.56 180 top
R50  65.72,55.56 180 top
R51  62.23,53.34 0 top
R52  58.74,53.34 0 top
R54  58.74,57.78 0 top
R55  62.23,57.78 0 top
R57  38.73,19.05 90 top
R58  69.22,53.34 180 top
R59  69.22,55.56 180 top
R60  54.45,38.42 180 top
R61  57.78,38.42 180 top
R62  69.22,57.78 180 top
R63  41.27,55.56 0 top
R64  37.78,55.56 0 top
R65  34.29,55.56 0 top
R66  41.27,53.34 0 top
R67  37.78,53.34 0 top
R68  34.29,53.34 0 top
R69  37.78,57.78 0 top
R70  34.29,57.78 0 top
R71  39.37,39.69 270 top
R72  37.47,39.69 270 top
R73  41.27,57.78 180 top
R74  36.83,19.05 270 top
R75  33.66,39.05 180 top
R76  33.66,37.15 180 top
S1  10.16,45.72 180 top
U$1  50,71 180 top

### Tracks (layer width: path | path; a pad name or v marks a point on that pad's centre or on a via)
!ALARM!  (via drill 0.4)
  Top 0.305: IC7.5 v40.64,32.7 40.64,34.13 44.29,37.78 v44.29,39.05 | IC13.12 IC13.11 52.39,41.91 52.07,41.59 51.59,41.59 51.12,41.12 v51.12,39.05 | R57.2 38.73,20.95 v41.27,23.5
  Bottom 0.305: v40.64,32.7 41.27,32.07 v41.27,23.5 | v44.29,39.05 v51.12,39.05
!ALM-RST_OUT!
  Top 0.61: CON1.11 57.02,4 57.15,4.13 57.15,6.03 57.78,6.67 57.78,15.48 LED6.C 57.8,21.57 55.56,23.81 IC2.13
!ALM_OUT!
  Top 0.61: U$1.11 51.75,70.81 51.75,70.8 51.75,66.36 50.48,65.09 26.99,65.09 22.23,60.33 IC3.13
!ALM_OUT_LED!
  Top 0.305: LED10.C 50.8,60.4 50.8,61.28 49.53,62.55 28.57,62.55 26.04,60.01 IC3.10
!ALM_RESET_IN!  (via drill 0.4)
  Top 0.305: U$1.9 58.75,71.11 58.74,71.12 58.74,72.39 58.1,73.03 22.23,73.03 21.59,73.66 19.37,73.66 18.41,72.71 18.41,69.22 9.53,60.33 9.53,51.44 10.79,50.16 12.38,50.16 12.38,50.24 S1.4
  Top 0.406: R52.1 58.1,53.34 v58.1,54.45 58.1,55.56 R48.2
  Bottom 0.305: U$1.9 58.75,70.5 58.74,70.48 58.74,55.09 v58.1,54.45
!EN_NEXT!  (via drill 0.6)
  Top 0.61: IC11.14 v73.66,56.2
  Bottom 0.61: U$1.5 72.75,70.84 72.71,70.8 72.71,57.15 v73.66,56.2
!EN_NEXT_LED!
  Top 0.305: IC11.15 72.39,49.85 72.71,50.16 72.71,55.88 71.91,56.68 R41.1
!ENABLE_IN!  (via drill 0.6)
  Top 0.406: R59.2 68.58,55.56 v68.58,54.61 68.58,53.51 R58.2
  Bottom 0.305: U$1.6 69.25,70.8 69.22,70.8 69.22,55.24 v68.58,54.61
!ENC_A_OC!
  Top 0.61: IC3.15 19.68,60.96 23.81,65.09 23.81,70.94 U$1.19
!ENC_B_OC!
  Top 0.61: IC3.14 20.95,60.64 27.3,66.99 27.3,70.94 U$1.18
!NEED_PWR!  (via drill 0.4)
  Top 0.305: IC11.16 v71.12,47.31 | v68.1,47.31 67.63,47.31 67.31,47.62 IC12.1 67.31,49.85 66.67,50.48 66.67,52.7 65.09,54.29 65.09,55.4
  Top 0.406: R40.2 R50.2 65.09,55.4
  Bottom 0.305: v68.1,47.31 v71.12,47.31
!NXT_TMR_START!
  Top 0.305: IC2.1 59.37,33.97 58.42,34.92 54.29,34.92 48.58,40.64 IC13.8
!NXT_TMR_STOP!
  Top 0.305: IC4.2 13.65,24.45 13.97,24.13 17.46,24.13 17.78,24.45 | 17.78,24.45 R19.1 | IC2.16 59.37,24.77 59.69,24.45 63.5,24.45 65.72,22.23 65.72,17.14 66.04,16.83 66.04,2.54 64.14,0.64 20.95,0.64 19.37,2.22 19.37,11.75 18.1,13.02 18.1,24.13 17.78,24.45
!OFF!  (via drill 0.4)
  Top 0.305: R49.2 61.59,55.56 v61.59,54.45 | 61.59,53.51 R51.1
  Top 0.406: v61.59,54.45 61.59,53.51
  Bottom 0.305: U$1.8 62.25,70.82 62.23,70.8 62.23,55.09 v61.59,54.45
!OFF_OUT!
  Top 0.61: CON1.12 60.5,5.89 61.28,6.67 61.28,15.48 LED5.C 61.28,15.52 61.28,21.59 60.33,22.54 58.42,22.54 56.83,24.13 IC2.14
!PROPORTIONAL!  (via drill 0.6)
  Top 0.406: R65.1 33.66,55.56 v33.66,54.61 33.66,53.51 R68.1
  Bottom 0.305: U$1.16 34.25,70.84 34.29,70.8 34.29,55.24 v33.66,54.61
!PROPORTIONAL_OUT!
  Top 0.61: CON1.9 50.04,4 50.16,4.13 50.16,6.03 50.8,6.67 LED15.C 50.8,21.59 53.02,23.81 IC2.11
!READY_OUT!
  Top 0.61: U$1.10 55.25,70.81 55.24,70.8 55.24,68.26 51.12,64.14 27.62,64.14 23.5,60.01 IC3.12
!READY_OUT_LED!
  Top 0.305: LED9.C 54.29,60.41 54.29,61.91 53.02,63.18 27.94,63.18 24.77,60.01 IC3.11
!REL_CTRL!  (via drill 0.6)
  Top 0.61: IC11.12 v76.2,55.88
  Bottom 0.61: U$1.4 76.25,70.85 76.2,70.8 v76.2,55.88
!REL_CTRL_LED!
  Top 0.305: IC11.13 74.93,56.2 75.4,56.67 R42.2
!REL_CTRL_START!
  Top 0.305: IC2.10 51.75,26.67 52.23,27.15 61.44,27.15 63.82,29.53 65.57,29.53 R22.2 69.69,29.68 70.17,30.16 IC6.2
  Top 0.406: 70.17,31.11 IC6.2 70.17,33.34 D3.C 69.85,33.34
!REL_PWR!  (via drill 0.6)
  Top 0.61: IC11.10 v78.74,55.24
  Bottom 0.61: U$1.3 79.69,71 | 79.69,71 79.69,71.12 | 79.69,71 79.69,56.2 v78.74,55.24
!REL_PWR_LED!
  Top 0.305: IC11.11 77.47,55.24 78.89,56.67 R43.2
!REVERSE!  (via drill 0.6)
  Top 0.406: R64.1 37.15,55.56 v37.15,54.61 37.15,53.51 R67.1
  Bottom 0.305: U$1.15 37.75,70.83 37.78,70.8 37.78,55.24 v37.15,54.61
!REVERSE_OUT!
  Top 0.61: CON1.10 53.53,4 53.66,4.13 53.66,6.03 54.29,6.67 LED8.C IC2.12
!S-ON!
  Top 0.305: IC14.2 IC14.13 R71.1
!S-ON_OUT!
  Top 0.61: CON1.13 64.14,4.13 64.14,6.03 64.77,6.67 64.77,15.47 LED4.C 64.8,21.88 63.18,23.5 58.74,23.5 58.1,24.13 IC2.15
+5V  (via drill 0.4, 0.6)
  Top 0.305: R59.1 70.64,55.56 70.96,55.88 70.96,58.74 71.28,59.05 71.95,59.05 LED19.A | IC4.8 12.38,31.91 12.38,32.23 12.7,32.54 12.7,33.19 R20.1 | 23.01,29.53 23.01,29.54 C22.1
  Top 0.406: IC6.8 71.44,24.77 71.12,24.45 71.12,23.96 R24.1 | 67.42,42.83 IC12.14
  Top 0.61: 87.79,20.32 C9.+ | v33.34,29.53 30.16,29.53 29.21,28.57 27.94,28.57 26.99,29.53 24.77,29.53 | IC9.16 24.77,29.53 | IC12.14 v67.31,44.45 | R16.1 51.12,57.78 51.12,56.52 | 24.4,42.97 IC5.4 22.86,44.77 21.91,45.72 19.68,45.72 19.05,46.35 IC5.8 17.51,48.47 C12.1 17.31,48.58 15.88,48.58 14.92,49.53 14.92,55.88 13.97,56.83 LED7.A | 24.4,42.97 C10.1 | IC7.14 47.17,25.75 C15.1 | L1.2 79.45,26.76 78.58,27.62 | 78.58,27.62 78.58,36.04 76.52,38.1 v69.85,38.1 | IC12.14 68.66,42.94 C26.1 | IC12.14 67.31,41.27 v66.04,40.01 64.45,38.42 R61.1 58.59,39.36 57.78,40.16 C27.1 56.4,42.7 IC13.14 56.2,44.45 55.88,44.77 v54.93,44.77 | 24.77,29.53 23.01,29.53 | 79.38,63.18 84.77,63.18 87,60.96 87,57.78 R1.1 | 79.38,63.18 75.88,63.18 | 75.88,63.18 72.07,63.18 | 72.07,63.18 66.67,63.18 65.09,61.59 65.09,60.39 LED18.A 65.09,60.25 v65.09,59.21 | 84.14,19.05 R9.1 | C13.1 12.38,31.91 | IC4.4 v16.19,27.62 14.92,28.89 13.02,28.89 12.38,29.53 IC4.8 | R50.1 v66.52,54.13 | IC7.14 45.72,26.83 45.09,27.46 v37.15,27.46 | C22.1 v22.86,30.96 | LED21.A 78.98,60.25 79.06,60.33 79.06,62.87 79.38,63.18 | LED20.A 75.49,60.25 75.56,60.33 75.56,62.87 75.88,63.18 | LED19.A 72,60.25 72.07,60.33 72.07,63.18 | v63.02,54.61 R49.1 | v59.53,54.61 R48.1 | LED29.A 35.05,61.09 35.56,61.59 38.42,61.59 | 38.42,61.59 48.58,61.59 49.21,60.96 49.21,56.83 49.53,56.52 51.12,56.52 | 54.61,56.52 55.56,56.52 55.88,56.2 v55.88,53.5 54.77,53.5 v51.44,50.16 | 54.61,56.52 51.12,56.52 | R15.1 54.61,57.78 54.61,56.52 | LED28.A 38.49,60.25 38.42,60.33 38.42,61.59 | IC14.14 42.35,42.9 C33.1 v42.55,41.27 | v40.32,36.83 40.64,36.83 v43.81,40.01 | R76.1 37.78,37.15 v38.1,36.83 38.1,34.45 v38.26,34.29
  Top 0.61: 78.58,27.62 76.83,25.87 C16.1 71.48,25.87 IC6.8 | R22.1 67.58,31.28 IC6.4 67.63,32.7 67.94,33.02 v67.94,38.1 | IC7.14 R3.1 R4.1 | 24.4,42.97 26.25,42.97 26.99,42.23 v26.99,36.83
  Bottom 0.61: v55.88,53.5 59.53,53.5 | 59.53,53.5 63.02,53.5 | 63.02,53.5 65.88,53.5 v66.52,54.13 66.52,57.78 v65.09,59.21 | v63.02,54.61 63.02,53.5 | v42.55,41.27 v43.81,40.01 v52.07,40.01 54.93,42.86 v54.93,44.77 53.34,44.77 51.44,46.67 v51.44,50.16 | v38.26,34.29 36.99,34.29 35.56,32.86 35.56,29.53 | v26.99,36.83 v38.1,36.83 v40.32,36.83 | v59.53,54.61 59.53,53.5 | v69.85,38.1 v67.94,38.1 v66.04,40.01 | v33.34,29.53 35.56,29.53 | v16.19,27.62 19.53,27.62 v22.86,30.96 | 35.56,29.53 35.56,29.05 v37.15,27.46
  pour Top (isolate 0.406, no thermals): 83.19,27.3 83.19,22.86 84.14,21.91 87.31,21.91 89.53,24.13 91.12,24.13 91.76,23.5 91.76,21.27 88.9,18.41 81.6,18.41 81.6,24.13 81.28,24.45 79.69,24.45 79.38,24.77 79.38,27.3
+24V  (via drill 0.6)
  Top 0.61: IC2.9 50.48,22.86 v49.21,21.59 R33.1 | IC3.9 27.3,57.47 26.83,56.99 17.94,56.99 17.46,57.47 17.46,62.87 20.32,65.72 20.32,70.93 U$1.20 | 90.33,37.78 90.33,35.24 96.84,35.24 96.84,18.73 80.01,1.91 74.61,1.91 | 90.33,37.78 C4.+ 90.49,40.32 90.49,45.09 87.03,48.55 IC11.9 80.01,54.93 81.6,56.52 88.9,56.52 D1.C 89.04,56.52 90.17,56.52 90.49,56.83 90.49,62.87 89.22,64.14 89.22,72.71 87.95,73.98 v22.54,73.98 | R2.1 83.98,36.36 85.41,37.78 90.33,37.78 | v52.7,21.59 R14.1 | v56.2,21.59 R12.1 | v59.69,21.59 R11.1 | v63.18,21.59 R10.1 | 74.61,1.91 69.85,1.91 69.22,2.54 69.22,14.92 66.67,17.46 v66.67,21.59 | CON1.16 74.61,3.89 74.61,1.91
  Bottom 0.61: v49.21,21.59 v52.7,21.59 v56.2,21.59 v59.69,21.59 v63.18,21.59 v66.67,21.59 | U$1.20 20.32,71.07 20.32,73.03 21.27,73.98 v22.54,73.98
  pour Top (isolate 0.406, no thermals): 92.39,30.16 90.49,30.16 90.49,31.11 90.17,31.43 88.58,31.43 88.58,35.88 87.63,36.83 87.63,41.59 92.08,41.59 92.08,31.11 92.39,30.8
ALARM  (via drill 0.4)
  Top 0.305: IC13.10 v51.12,44.45 | v32.07,45.72 31.11,45.72 30.16,46.67 30.16,48.58 26.99,51.75 26.35,51.75 26.03,52.07 IC3.7
  Top 0.406: IC3.7 26.03,54.3 25.72,54.61 22.54,54.61 22.23,54.29 IC3.4
  Bottom 0.305: v32.07,45.72 49.85,45.72 v51.12,44.45
ALM+  (via drill 0.4)
  Top 0.305: v44.29,34.92 45.24,33.97 v51.75,33.97 | R61.2 R60.1 v55.25,36.99 v55.24,36.99 | v23.81,35.88 21.27,33.34 21.27,22.23 19.37,20.32 19.37,13.65 20.64,12.38 20.64,2.86 21.59,1.91 33.97,1.91 34.61,2.54 34.61,5.4 35.56,6.35 38.73,6.35 39.37,5.71 39.37,4 CON1.6
  Bottom 0.305: v55.24,36.99 52.23,33.97 v51.75,33.97 | v44.29,34.92 43.5,35.72 25.88,35.72 25.72,35.88 v23.81,35.88
ALM++
  Top 0.305: R60.2 C29.1 53.66,41.27 53.98,41.59 54.77,41.59 54.93,41.75 IC13.13
ALM-RST  (via drill 0.4)
  Top 0.305: v49.85,37.47 47.15,40.16 47.15,44.45 48.42,45.72 51.12,45.72 52.39,46.99 IC13.4 52.39,50.16 54.61,52.39 56.2,52.39 56.99,53.18 56.99,57.63 57.15,57.78 R54.1 | v49.85,35.88 50.8,35.88 53.02,33.66 54.93,33.66 55.56,33.02 IC2.4
  Bottom 0.305: v49.85,37.47 v49.85,35.88
BOOST
  Top 0.406: IC1.7 85.57,28.89 C6.1
COIN+
  Top 0.61: CON1.8 46.55,4 46.67,4.13 46.67,6.03 47.31,6.67 LED2.C
EN_NEXT  (via drill 0.4)
  Top 0.305: IC11.3 IC11.2 72.39,41.59 v70.48,39.69 | v38.42,46.67 37.47,46.67 35.56,44.77 IC14.10 | v52.39,44.45 53.34,44.45 55.88,46.99 58.1,46.99 58.9,46.2 58.9,40.32 60.01,39.21 63.66,39.21 v65.72,41.27
  Bottom 0.305: v38.42,46.67 38.73,46.35 50.48,46.35 v52.39,44.45 | v65.72,41.27 66.36,41.27 67.94,39.69 v70.48,39.69
EN_NEXT_OFF  (via drill 0.4)
  Top 0.305: IC4.3 14.92,26.99 14.61,27.3 10.16,27.3 9.53,27.94 9.53,34.29 13.02,37.78 v23.81,37.78 | v35.88,38.73 35.88,40.96 36.83,41.91 IC14.11
  Bottom 0.305: v35.88,38.73 24.77,38.73 v23.81,37.78
ENABLE  (via drill 0.4)
  Top 0.305: v60.33,40.01 63.34,40.01 64.77,41.43 IC12.12 64.77,44.93 66.2,46.35 68.26,46.35 68.9,46.99 68.9,49.21 67.47,50.64 67.47,56.52 67.63,56.67 69.69,56.67 70.02,57 R62.1 | v54.13,36.99 54.93,36.2 60.01,36.2 v60.48,36.67 | v50.96,34.77 45.88,34.77 44.93,35.72 43.81,35.72 42.55,34.45 42.55,33.34 v43.02,32.86 43.97,32.86 44.45,32.38 IC7.2 | IC7.12 v43.18,24.45
  Bottom 0.305: v54.13,36.99 51.91,34.77 v50.96,34.77 | v60.33,40.01 60.48,39.85 v60.48,36.67 | v43.18,24.45 43.18,32.7 v43.02,32.86
ENC_A
  Top 0.305: IC9.3 27.3,26.99 27.62,27.3 29.21,27.3 30.48,28.57 33.97,28.57 34.61,29.21 34.61,33.02 34.29,33.34 31.11,33.34 27.94,36.51 27.94,47.94 26.04,49.85 21.59,49.85 19.68,51.75 IC3.2
ENC_A_OUT
  Top 0.406: IC9.13 28.57,32.7 27.94,33.34 26.99,33.34 24.77,35.56 24.77,38.42 24.45,38.73 6.03,38.73 5.08,39.69 5.08,57.78 13.34,66.04 13.34,70.8 13.25,70.89 U$1.22
ENC_B
  Top 0.305: IC9.5 29.84,26.99 30.8,27.94 34.29,27.94 35.24,28.89 35.24,33.34 34.61,33.97 31.27,33.97 28.57,36.67 28.57,48.26 26.35,50.48 22.23,50.48 20.95,51.75 IC3.3
ENC_B_OUT
  Top 0.406: IC9.11 31.11,32.38 29.53,33.97 27.3,33.97 25.4,35.88 25.4,38.73 24.77,39.37 6.35,39.37 5.71,40.01 5.71,57.47 16.83,68.58 16.83,70.92 U$1.21
GND  (via drill 0.4, 0.6, 4.3 pad 7.2)
  other vias: 4,71 96,71 96,4 4,4 84.77,35.24 84.77,32.7 95.25,33.97 95.25,26.35 74.93,26.99 57.47,48.3 71.44,33.02 11.27,25.24 28.89,23.18 23.5,25.08 79.53,44.61 79.06,23.18 29.84,32.23 73.5,41.12 70.8,29.53 37.15,51.91 70.48,60.64 68.58,51.75 80.8,44.61 46.35,49.85 40.01,51.91 40.01,50.32 32.07,49.21 32.07,47.94 33.02,46.67 38.58,54.77 35.08,54.77 27.3,54.93 28.57,54.93 28.57,53.66 28.57,52.39 17.46,45.4 17.46,44.13 17.46,42.86 26.04,48.58 26.04,47.31 33.66,51.75 38.1,32.54 38.1,30 46.99,22.86 48.26,22.86 28.57,29.69 42.07,48.58 40.64,44.77 42.07,47.47 44.13,44.77 49.53,31.11 49.53,32.38 47.47,49.37 47.47,48.1 73.5,40.01 56.67,41.27 56.67,40.16 31.43,41.27 31.43,40.32 70.48,59.69 85.72,59.69 85.72,60.64 84.77,33.97 84.77,31.43 95.25,32.7 95.25,31.43 89.22,30.16 89.22,29.21 89.22,28.26 87,23.5 79.06,21.91 79.06,20.64 79.06,19.37 79.06,18.1 68.26,28.57 74.93,28.26 72.39,22.54 11.27,26.35 72.39,21.27 17.3,32.54 18.41,32.54 79.53,45.88 78.26,45.88 78.26,44.61 46.04,48.58 68.58,50.8 58.74,48.26 59.69,46.83 57.94,45.72 56.83,45.72 36.51,23.5 35.08,26.04 35.08,27.15 35.08,24.92 22.54,25.08 28.89,24.13 48.26,31.11 48.26,32.38 22.54,26.67 23.5,26.67 11.43,28.42 10.64,29.05 61.28,51.75 61.28,50.8 55.24,51.44 56.52,50.8 82.55,2.86 97.79,18.1 97.79,56.83 97.79,37.15
  pour Bottom (isolate 0.254, rank 3, no thermals): 98,0 2,0 arc-90 0,2 0,73 arc-90 2,75 98,75 arc-90 100,73 100,2 arc-90
  pour Top (isolate 0.254, rank 3, no thermals): 0,2 0,73 arc-90 2,75 98,75 arc-90 100,73 100,2 arc-90 98,0 2,0 arc-90
N$1
  Top 0.406: R7.2 R8.1 90.33,26.52 91.44,27.62 91.44,28.23 IC1.1
N$2
  Top 0.61: R3.2 45.7,18.25 LED2.A
N$4
  Top 0.61: R4.2 42.2,18.25 LED3.A
N$5
  Top 0.305: R13.1 LED7.C
N$6
  Top 0.305: R1.2 82.39,60.19 LED1.A
N$8
  Top 0.406: IC1.3 93.5,29.53 R5.1 | 93.96,29.99 R5.1 | D2.A 93.98,31.73 93.98,29.84 R5.1
N$11  (via drill 0.4)
  Top 0.305: IC5.2 20.32,44.45 v20.64,44.77 | IC5.6 v21.59,46.67 24.45,46.67 | 24.45,46.67 R18.1 | 24.45,46.67 C10.2
  Bottom 0.305: v21.59,46.67 21.59,45.72 v20.64,44.77
N$12
  Top 0.305: R20.2 14.61,33.19 14.61,32.54 14.92,32.23 IC4.6 14.92,30.16 15.56,29.52 C11.1 R19.2
N$13
  Top 0.406: R6.2 R7.1
N$14
  Top 0.406: IC1.2 92.86,28.89 C5.1
N$15
  Top 0.305: R23.2 72.22,29.36 70.48,27.62 69.22,27.62 68.9,27.3 IC6.6
  Top 0.406: IC6.6 68.9,24.77 69.22,24.45 69.22,23.96 R24.2 C14.1
N$16
  Top 0.305: IC12.13 66.04,44.93 66.83,45.72 68.58,45.72 70.17,47.31 70.17,49.53 70.64,50.01 71.28,50.01 71.6,50.33 C28.1 71.75,51.27 71.75,52.7 71.12,53.34 R58.1
N$17
  Top 0.305: R70.1 33.49,60.21 LED29.C
N$18
  Top 0.406: R31.1 24.61,15.59 LED11.C
N$19  (via drill 0.6)
  Top 0.406: R32.1 v33.02,19.68 | LED12.C 33.3,15.52 33.34,15.56 v33.34,17.14
  Bottom 0.406: v33.02,19.68 33.02,17.46 v33.34,17.14
N$20
  Top 0.305: 72.87,33.32 73.01,33.32 73.03,33.34 73.03,32.38 73.34,32.07 R23.1
  Top 0.406: 72.87,33.32 D3.A
N$21
  Top 0.305: R52.2 C25.1 59.54,50.33 59.05,49.85 53.98,49.85 53.66,49.53 IC13.3
N$22
  Top 0.305: R33.2 49.21,15.51 LED15.A
N$23
  Top 0.305: R51.2 C24.1 64.14,51.12 64.77,50.48 IC12.3
N$27
  Top 0.305: IC14.1 40.64,49.53 40.8,49.69 41.59,49.69 42.07,50.16 C30.1
  Top 0.406: R66.2 C30.1 41.91,50.95
N$28
  Top 0.305: 38.42,50.95 38.42,50.16 38.1,49.85 IC14.3
  Top 0.406: R67.2 C31.1 38.42,50.95
N$29
  Top 0.305: R68.2 C32.1 35.08,50.16 35.56,49.69 IC14.5
N$30
  Top 0.305: R69.1 36.98,60.22 LED28.C
N$31
  Top 0.305: R10.2 63.18,15.52 LED4.A
N$32
  Top 0.305: IC3.16 18.41,62.55 21.59,65.72 21.59,72.71 21.27,73.03 19.68,73.03 19.05,72.39 19.05,65.72 16.51,63.18 16.51,60.33 15.56,59.37 R13.2
N$33
  Top 0.305: 42.06,60.24 LED30.A 41.91,60.11 41.91,59.37 41.59,59.05 40.64,59.05 40.48,58.89 R73.2
N$34
  Top 0.305: R11.2 LED5.A
N$35
  Top 0.305: R12.2 LED6.A
N$36
  Top 0.305: R14.2 LED8.A
N$38
  Top 0.305: R54.2 59.54,60.24 LED23.A
N$39
  Top 0.305: R55.2 63.03,60.23 LED24.A
N$40
  Top 0.305: R41.2 73.51,60.21 LED19.C
N$41
  Top 0.305: R40.1 66.52,60.25 LED18.C
N$43
  Top 0.305: R42.1 77,60.2 LED20.C
N$45
  Top 0.305: R43.1 80.49,60.19 LED21.C
N$46
  Top 0.305: R62.2 68.42,60.25 LED27.A
N$49
  Top 0.305: R15.2 LED9.A
N$50
  Top 0.305: R16.2 52.61,57.84 52.61,60.19 LED10.A
N$51
  Top 0.406: LED13.C 21.21,15.5 21.27,15.56 21.27,19.05 21.91,19.68 R29.2
N$53
  Top 0.406: R30.2 29.84,17.63 29.84,15.5 LED14.C
N$55
  Top 0.305: R57.1 38.7,18.25 LED26.A
N$56
  Top 0.305: R74.2 36.83,17.14 36.51,16.83 35.56,16.83 35.24,16.51 35.24,15.54 LED31.A
NEAR+
  Top 0.61: CON1.7 43,5.75 43.75,6.5 43.75,15.45 LED3.C
NEED_PWR
  Top 0.305: U$1.7 65.75,63.21 63.98,61.44 63.98,54.45 66.04,52.39 IC12.2
NXT_TMR_START  (via drill 0.4)
  Top 0.305: IC7.4 v41.91,32.7 41.91,34.61 45.09,37.78 v45.09,41.12 | IC13.9 v49.85,41.12 | IC7.11 41.91,24.61 v42.07,24.45
  Bottom 0.305: v49.85,41.12 v45.09,41.12 | v41.91,32.7 41.91,24.61 v42.07,24.45
OFF  (via drill 0.4)
  Top 0.305: R55.1 60.8,57.78 60.48,57.47 60.48,50.16 60.8,49.85 63.18,49.85 63.5,49.53 IC12.4 63.5,45.4 62.87,44.77 v61.59,44.77 | IC2.3 56.83,30.16 57.15,29.84 60.33,29.84 61.91,31.43 61.91,36.2 v61.59,36.51
  Bottom 0.305: v61.59,44.77 v61.59,36.51
PAO+
  Top 0.406: R26.1 28.11,20.17 27.62,19.68 26.35,19.68 | 26.35,19.68 R29.1 | 26.35,19.68 26.35,15.56 LED11.A 26.35,15.45 26.35,13.65 25.4,12.7 25.4,4.45 25.5,4.34 CON1.2
PAO++  (via drill 0.4)
  Top 0.305: v26.67,28.26 26.04,27.62 IC9.2 26.04,24.77 26.35,24.45 26.35,23.65 C20.1 | IC9.14 v27.3,32.38
  Top 0.406: C20.1 R26.2
  Bottom 0.305: v26.67,28.26 27.3,28.89 v27.3,32.38
PAO-
  Top 0.305: R25.1 21.43,21.59 20,20.16 20,13.97 20.95,13.02 22.23,13.02
  Top 0.406: R31.2 23.01,15.71 LED13.A 22.86,15.44 22.86,13.65 22.23,13.02 22.23,4.13 22.1,4 CON1.1
  Top 0.61: R31.2 22.86,17.78
PAO--  (via drill 0.4)
  Top 0.254: C21.1 R25.2
  Top 0.305: v25.4,28.26 24.77,27.62 IC9.1 24.77,23.65 C21.1 | IC9.15 v26.04,32.38
  Top 0.406: C21.1 24.61,23.66
  Bottom 0.305: v25.4,28.26 26.04,28.89 v26.04,32.38
PBO+
  Top 0.254: R27.1 R32.2
  Top 0.406: R32.2 29.21,19.68 28.26,18.73 28.26,15.56 LED14.A 28.2,15.3 28.26,15.24 28.26,13.65 28.89,13.02 28.89,4.11 CON1.3
PBO++  (via drill 0.4)
  Top 0.254: C19.1 R27.2
  Top 0.305: v31.11,26.99 IC9.6 31.11,24.77 31.43,24.45 31.43,23.66 C19.1 | IC9.10 v32.38,32.38
  Bottom 0.305: v31.11,26.99 31.11,29.53 32.38,30.8 v32.38,32.38
PBO-
  Top 0.254: R30.1 32.7,17.78 35.24,20.32 35.24,21.44
  Top 0.406: 35.24,21.44 R28.1 | R30.1 31.6,15.6 LED12.A 31.7,15.29 31.75,15.24 31.75,13.65 32.38,13.02 32.38,4.13 32.5,4.01 CON1.4
PBO--  (via drill 0.4)
  Top 0.254: C18.1 R28.2
  Top 0.305: v32.38,26.99 IC9.7 32.38,24.6 C18.1 33.34,23.65 | IC9.9 v33.66,32.38
  Bottom 0.305: v33.66,32.38 33.66,31.11 32.38,29.84 v32.38,26.99
PROPORTIONAL  (via drill 0.4)
  Top 0.305: R70.2 35.09,56.84 34.92,56.67 32.7,56.67 32.38,56.36 32.38,50.16 32.7,49.85 33.97,49.85 34.29,49.53 IC14.6 34.29,46.04 33.02,44.77 31.11,44.77 30.48,44.13 30.48,42.55 29.84,41.91 29.84,37.15 31.75,35.24 35.24,35.24 36.51,33.97 36.51,29.21 37.47,28.26 52.7,28.26 v53.02,27.94 | IC2.6 v53.02,30.48
  Bottom 0.305: v53.02,30.48 v53.02,27.94
PWR_STABLE  (via drill 0.4)
  Top 0.305: v21.59,44.45 IC5.3 21.59,40.79 R17.1 24.45,40.64 26.04,39.05 26.04,36.51 v27.78,34.77 | IC7.1 45.72,32.23 v43.66,34.29 | v19.68,50.16 18.41,51.44 IC3.1
  Bottom 0.305: v21.59,44.45 22.54,45.4 22.54,47.31 v19.68,50.16 | v27.78,34.77 36.51,34.77 36.83,35.08 42.86,35.08 v43.66,34.29
REL_CTRL  (via drill 0.4)
  Top 0.305: IC7.13 v44.45,24.45 | v67.94,40.64 64.77,37.47 59.85,37.47 59.37,36.99 v56.2,36.99 | v52.55,33.02 51.44,33.02 51.12,33.34 47.78,33.34 46.83,32.38 v46.83,30.96 | R21.1 76.2,40.92 IC11.5 IC11.4 74.93,43.97 74.61,44.29 71.44,44.29 71.12,43.97 IC11.1 71.12,41.59 v70.17,40.64 68.9,39.37 IC6.3
  Bottom 0.305: v70.17,40.64 v67.94,40.64 | v56.2,36.99 56.2,36.67 v52.55,33.02 | v46.83,30.96 44.45,28.57 v44.45,24.45
REL_CTRL_START
  Top 0.305: IC7.3 43.18,30.16 43.34,30 51.59,30 51.75,30.16 IC2.7
REL_PWR
  Top 0.305: IC7.6 39.37,30 39.85,29.53 55.09,29.53 55.72,28.89 60.64,28.89 62.71,30.96 62.71,36.04 63.5,36.83 65.25,36.83 70.17,41.75 70.17,43.97 71.12,44.93 76.68,44.93 77.47,44.13 IC11.6 | R39.1 78.42,41.43 78.74,41.75 IC11.7
  Top 0.406: IC11.7 IC11.6
REVERSE  (via drill 0.4)
  Top 0.305: R69.2 38.58,57 38.26,56.67 36.35,56.67 36.04,56.36 36.04,50.32 36.83,49.53 IC14.4 36.83,47.15 33.81,44.13 31.75,44.13 31.11,43.5 31.11,42.23 30.48,41.59 30.48,37.47 32.07,35.88 35.56,35.88 37.15,34.29 37.15,29.53 37.78,28.89 53.98,28.89 v54.29,28.57 | IC2.5 v54.29,30.48
  Bottom 0.305: v54.29,30.48 v54.29,28.57
S-ON
  Top 0.305: IC14.12 38.1,41.91 37.47,41.27 R72.1
S-ON_IN  (via drill 0.6)
  Top 0.406: R63.1 40.64,55.56 v40.64,54.61 40.64,53.51 R66.1
  Bottom 0.305: U$1.14 41.25,55.22 v40.64,54.61
S-ON_SAFE  (via drill 0.4)
  Top 0.305: IC7.8 37.59,25.75 v37.15,26.19 | v46.35,35.56 47.47,36.67 50.96,36.67 53.34,34.29 56.2,34.29 58.1,32.38 IC2.2
  Bottom 0.305: v37.15,26.19 37.94,26.99 37.94,28.1 36.35,29.69 36.35,32.54 37.31,33.5 38.89,33.5 39.53,34.13 42.7,34.13 43.34,33.5 44.29,33.5 v46.35,35.56
S-ON_SEL  (via drill 0.4)
  Top 0.305: R72.2 R71.2 39.52,38.73 | v39.85,33.34 39.85,35.72 39.52,36.04 39.52,38.73 | IC7.10 40.64,24.61 v40.48,24.45 | R73.1 43.18,57.78 43.5,57.47 43.5,46.67 45.09,45.09 45.09,42.55 41.27,38.73 39.52,38.73
  Bottom 0.305: v39.85,33.34 39.85,25.08 v40.48,24.45
S-RDY  (via drill 0.4)
  Top 0.305: IC7.9 39.37,24.13 | 39.37,24.13 36.83,21.59 R74.1 | IC14.8 31.94,42.9 v31.91,42.86 | 39.37,24.13 37.47,24.13 36.2,25.4 36.2,28.57 35.88,28.89 35.88,33.66 34.92,34.61 31.43,34.61 29.21,36.83 29.21,42.55 v29.53,42.86 29.53,48.26 26.67,51.12 25.72,51.12 24.76,52.07 IC3.6
  Top 0.406: IC3.5 IC3.6
  Bottom 0.305: v29.53,42.86 v31.91,42.86
S-RDY+  (via drill 0.4)
  Top 0.305: R75.2 R76.2 31.91,37.15 v31.27,37.78 | v23.5,36.83 20.64,33.97 20.64,22.54 18.73,20.64 18.73,13.34 20,12.06 20,2.54 21.27,1.27 34.77,1.27 35.88,2.38 35.88,3.81 36,3.93 CON1.5
  Bottom 0.305: v31.27,37.78 26.67,37.78 25.72,36.83 v23.5,36.83
S-RDY++
  Top 0.305: R75.1 C34.1 34.29,41.12 IC14.9
SWITCH
  Top 0.305: 81.73,30.01 81.47,29.76 L1.1
  Top 0.457: IC1.6 85.57,29.53 C6.2
  Top 1.016: C6.2 81.73,30.01
VIN
  Top 0.61: U$1.2 83.25,70.87 83.19,70.8 83.19,68.58 88.9,62.87 D1.A
VREF  (via drill 0.6)
  Top 0.61: CON1.14 67.5,3.3 67.63,3.17 67.63,1.59 68.26,0.95 82.23,0.95 99.06,17.78 99.06,57.47 v90.81,65.72
  Bottom 0.61: U$1.13 44.75,72.69 46.35,74.3 87.63,74.3 89.22,72.71 89.22,67.31 v90.81,65.72

### Text on the board
tPlace: A | B | 24V | Aoc | Boc | GND | PRP | REV | ON | REF | GND | ALM | RDY | NED | EN | NXT | CTR | PWR | 24V | GND | Encoder Out | Spindle Control | Status | ARST | OFF | Enable | Relay | Power | Stable | soldernerd.com | Rev B - 2019 | Alarm Reset | Yaskawa Servo Interface | From Servo | To Servo | PAO- | PAO+ | PBO+ | PBO- | RDY | ALM | NEAR | COIN | PROP | REV | ARST | OFF | S-ON | VREF | GND | +24V | GND
bPlace: Yaskawa Servo Interface | for analog speed control | Lukas Fässler - 2019 - Rev B | soldernerd.com